# EasyEDA Pro project ProPrj_IRIS_2026-04-09.epro, board PCB1
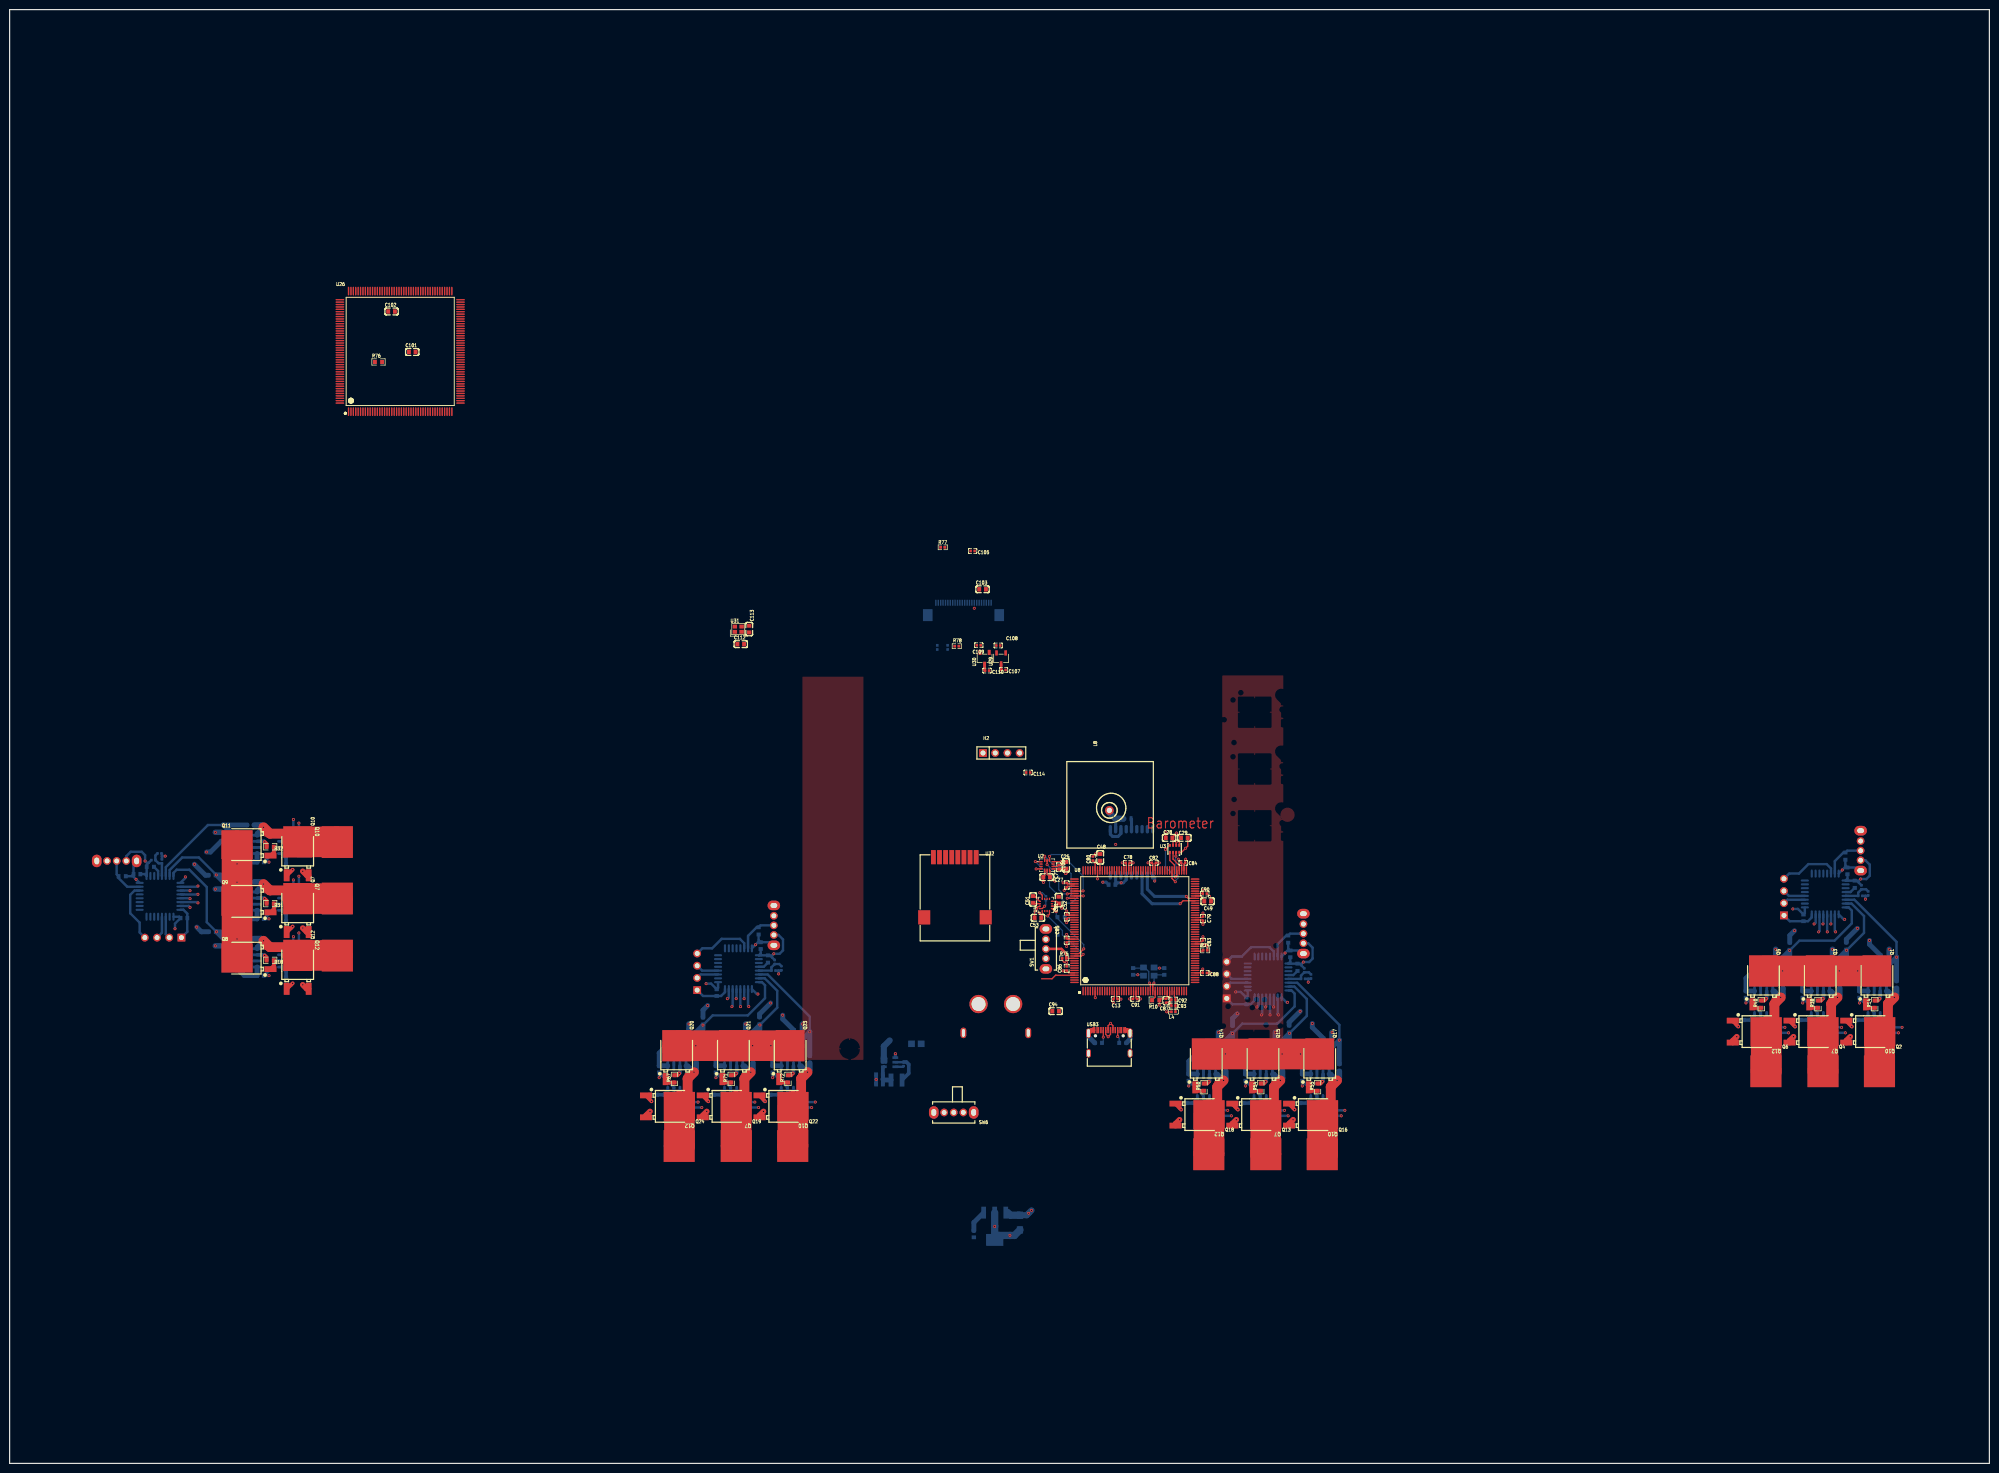
[diagram p2: board, top side]
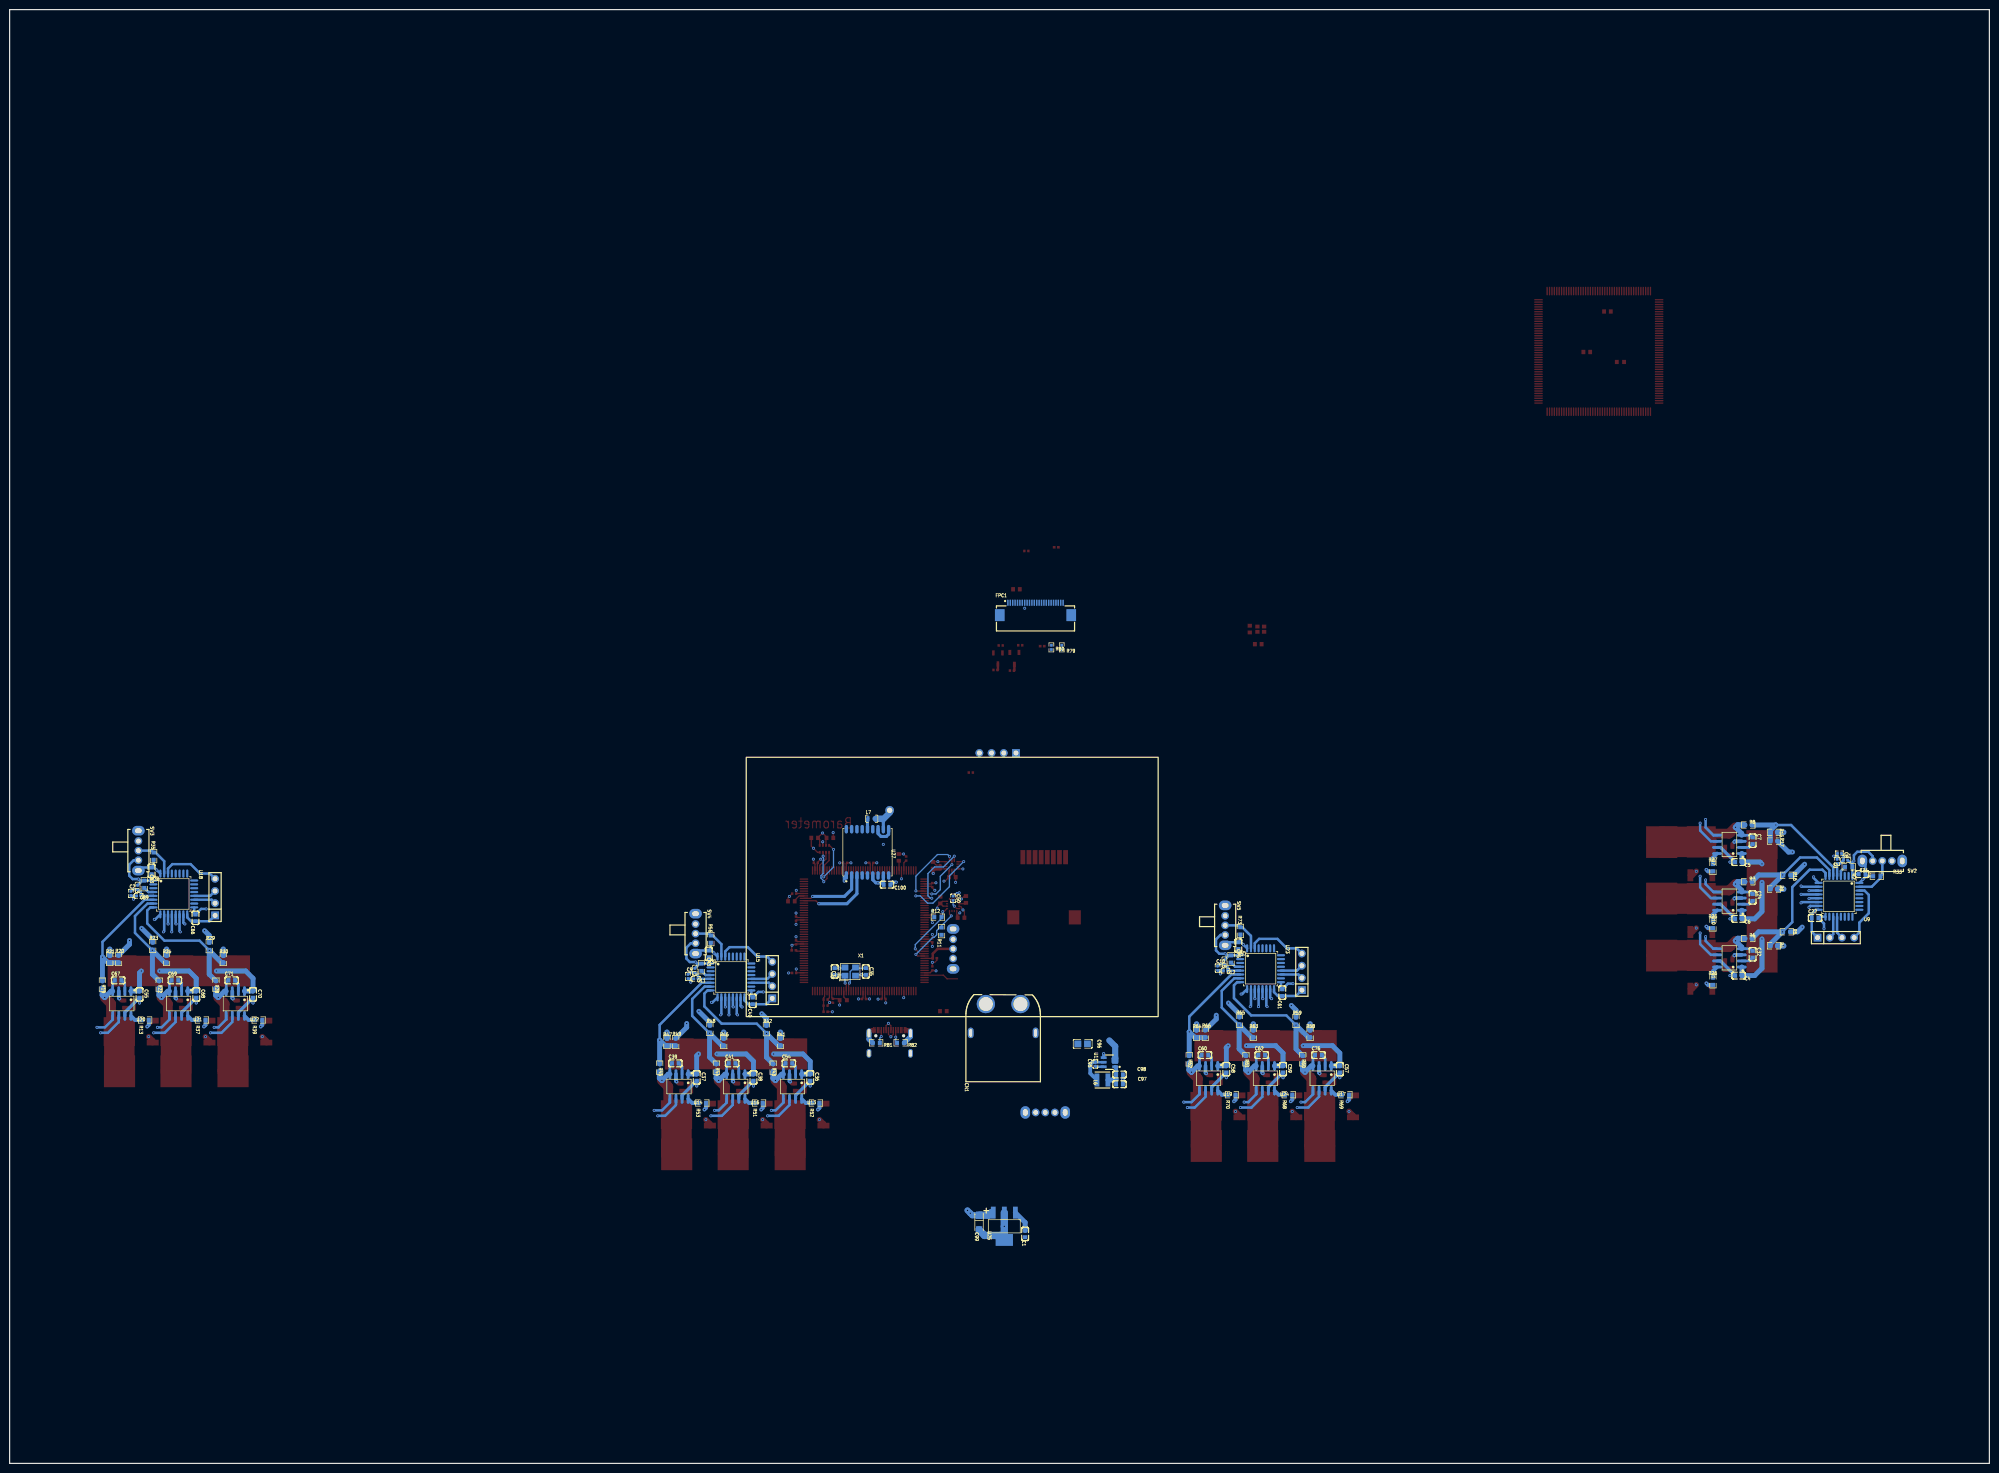
[diagram p3: board, bottom side, seen from below]

Outline 411.99 x 302.51 mm; copper layers: Top Layer, Ground, Power, Bottom Layer. Coordinates in mm from the lower left corner of the outline.
Outline path: rectangle 0,302.51 411.99,0
Stack: Top Layer 0.035mm Outer layer thickness 1oz / Dielectric1 0.2104mm 7628 RC49% 8.6mil / Ground 0.0152mm Inner layer thickness / Dielectric2 1.065mm 1.1mm H/HOZ Copper / Power 0.0152mm Inner layer thickness / Dielectric3 0.2104mm 7628 RC49% 8.6mil / Bottom Layer 0.035mm Outer layer thickness 1oz

## Design rules (mm)
template: JLCPCB Capability(Two Layers Board)
spacing copperThickness1oz (default): track to track 0.102, other pairs 0.152 to 0.3
spacing copperThickness2oz: track to track 0.203, other pairs 0.152 to 0.3
track width copperThickness1oz (default): min 0.127, default 0.254, max 2.54
track width copperThickness2oz: min 0.203, default 0.254, max 2.54
differential pair differentialPair (default): width min 0.127, default 0.254, max 2.54; gap min 0.152, default 0.152
via viaSize (default): diameter min 0.5, default 0.61, max 10; hole min 0.3, default 0.305, max 6.3

## Placement (name value [footprint] x y rotation side)
C1  10uF  [C0603]  200.66 47.75 90 bottom
C2  1uF  [C0402]  386.76 118.6 90 bottom
C3  100nF  [C0402]  31.69 125.28 90 bottom
C4  10uF  [C0603]  52.2 101.5 180 bottom
C5  10uF  [C0603]  52.2 125.13 180 bottom
C6  10uF  [C0603]  52.2 113.32 180 bottom
C7  100nF  [C0603]  49.28 129.57 270 bottom
C8  1uF  [C0402]  31.19 126.93 180 bottom
C9  1uF  [C0402]  270.81 101.33 90 bottom
C10  1uF  [C0402]  160.6 103.05 90 bottom
C11  100nF  [C0402]  269.16 100.82 0 bottom
C12  100nF  [C0402]  158.95 102.55 0 bottom
C13  100nF  [C0402]  230.12 96.65 0 top
C22  100nF  [C0603]  36.27 113.48 180 bottom
C24  100nF  [C0603]  49.28 117.76 270 bottom
C25  2.2uF  [C0603]  219.84 124.46 270 top
C27  10nF  [C0603]  215.8 121.99 180 top
C28  100nF  [C0603]  241.29 130.16 180 top
C29  100nF  [C0603]  244.46 130.16 0 top
C31  100nF  [C0603]  26.49 122.62 180 bottom
C32  100nF  [C0603]  49.28 105.95 270 bottom
C34  10pF  [C0603]  240.28 102.36 90 bottom
C35  10pF  [C0603]  233.81 102.36 270 bottom
C36  10uF  [C0603]  245.38 80.32 90 bottom
C37  10uF  [C0603]  269 80.32 90 bottom
C38  10uF  [C0603]  257.19 80.32 90 bottom
C39  100nF  [C0603]  273.45 83.24 180 bottom
C40  100nF  [C0603]  257.36 96.25 90 bottom
C41  100nF  [C0603]  261.64 83.24 180 bottom
C43  100nF  [C0603]  266.5 106.02 90 bottom
C48  2.2uF  [C0603]  226.95 126.11 90 top
C49  2.2uF  [C0603]  249.3 116.97 0 top
C50  220nF  [C0402]  215.65 117.6 270 bottom
C51  4.7uF  [C0603]  212.98 117.35 90 top
C52  100nF  [C0603]  218.31 117.22 90 top
C53  100nF  [C0603]  214 113.54 180 top
C54  100nF  [C0603]  249.83 83.24 180 bottom
C55  10uF  [C0603]  384.96 97.59 90 bottom
C57  10uF  [C0603]  135.18 82.04 90 bottom
C58  10uF  [C0603]  158.8 82.04 90 bottom
C59  10uF  [C0603]  146.99 82.04 90 bottom
C60  100nF  [C0603]  163.24 84.96 180 bottom
C61  100nF  [C0603]  147.15 97.97 90 bottom
C62  100nF  [C0603]  151.43 84.96 180 bottom
C63  100nF  [C0603]  382.45 123.3 90 bottom
C66  100nF  [C0603]  373.31 113.52 90 bottom
C67  100nF  [C0603]  389.4 100.52 180 bottom
C68  10uF  [C0603]  373.14 97.59 90 bottom
C69  100nF  [C0603]  377.59 100.52 180 bottom
C70  10uF  [C0603]  361.33 97.59 90 bottom
C71  100nF  [C0603]  365.78 100.52 180 bottom
C75  100nF  [C0603]  156.29 107.74 90 bottom
C76  100nF  [C0603]  139.62 84.96 180 bottom
C77  100nF  [C0402]  219.99 120.34 270 top
C78  100nF  [C0402]  232.66 124.97 180 top
C79  100nF  [C0402]  248.33 113.36 90 top
C80  100nF  [C0402]  225.43 125.86 270 top
C81  100nF  [C0402]  219.99 113.74 270 top
C82  100nF  [C0402]  238.12 124.97 180 top
C83  100nF  [C0402]  248.33 108.4 90 top
C84  100nF  [C0402]  244.22 124.97 180 top
C85  100nF  [C0402]  219.96 108.84 270 top
C86  100nF  [C0402]  219.96 103 270 top
C87  100nF  [C0402]  240.66 96.27 90 top
C88  100nF  [C0402]  248.73 102.05 180 top
C89  100nF  [C0402]  385.11 118.1 0 bottom
C90  100nF  [C0402]  248.71 118.56 180 top
C91  100nF  [C0402]  234.19 96.65 0 top
C92  100nF  [C0402]  242.19 96.52 0 top
C93  1uF  [C0402]  242.19 95.25 0 top
C94  4.7uF  [C0603]  217.68 94.11 0 top
C95  100nF  [C0402]  186.04 83.1 270 bottom
C96  10uF  [C0805]  188.69 87.31 180 bottom
C97  22uF  [C0603]  181.02 78.9 0 bottom
C98  22uF  [C0603]  181.02 80.92 0 bottom
C99  10uF  [CAP-SMD_L3.2-W1.6-RD-C7171]  210.25 50.11 270 bottom
C100  10uF  [C0603]  229.4 120.43 0 bottom
C101  2.2uF  [C0603]  83.78 231.27 0 top
C102  2.2uF  [C0603]  79.49 239.7 0 top
C103  15pF  [C0603]  202.47 181.9 0 top
C105  100nF  [C0402]  200.41 189.87 180 top
C106  100nF  [C0402]  218.31 124.08 90 top
C107  1uF  [C0402]  206.83 165.1 180 top
C108  1uF  [C0402]  205.74 170.2 180 top
C109  1uF  [C0402]  201.68 170.25 0 top
C110  1uF  [C0402]  203.4 164.97 180 top
C112  10pF  [C0603]  152.15 170.47 0 top
C113  10pF  [C0603]  153.91 173.61 270 top
C114  100nF  [C0402]  211.96 143.76 180 top
CN1  XT60PW-M  [CONN-TH_XT60PW-M]  205.23 92.58 90 bottom
FPC1  FPC-05F-24PH20  [FPC-SMD_24P-P0.50_FPC-05F-24PH20]  198.5 177.8 180 bottom
H1  HX PH254-01-04-Z-L11.5 straight pin header  [HDR-TH_4P-HX-PH254-01-04-Z-L11.5]  369.23 117.84 90 bottom
H2  HX PH254-01-04-Z-L11.5 straight pin header  [HDR-TH_4P-HX-PH254-01-04-Z-L11.5]  206.38 147.83 0 top
H3  HX PH254-01-04-Z-L11.5 straight pin header  [HDR-TH_4P-HX-PH254-01-04-Z-L11.5]  31.95 109.41 180 bottom
H4  HX PH254-01-04-Z-L11.5 straight pin header  [HDR-TH_4P-HX-PH254-01-04-Z-L11.5]  253.28 100.57 90 bottom
H5  HX PH254-01-04-Z-L11.5 straight pin header  [HDR-TH_4P-HX-PH254-01-04-Z-L11.5]  143.08 102.29 90 bottom
L1  BLM15PD121SN1D  [L0402]  29.92 125.53 180 bottom
L2  BLM15PD121SN1D  [L0402]  269.41 102.6 90 bottom
L3  BLM15PD121SN1D  [L0402]  385.36 119.87 90 bottom
L4  BLM15PD121SN1D  [L0402]  242.19 93.98 0 top
L5  BLM15PD121SN1D  [L0402]  159.21 104.32 90 bottom
L6  4.7uH  [IND-SMD_L3.0-W3.0-1]  184.57 79.77 180 bottom
L7  47nH  [IND-SMD_L1.8-W1.0]  232.58 134.14 180 bottom
L8  BWGNSCNX18-18W4  [ANT-TH_L18.0-W18.0_C9900026472]  228.85 135.89 0 top
NOREF  -  [Pad_e845]  377.37 81.59 0 top
NOREF#2  -  [Pad_e2491]  68.2 105.66 90 top
NOREF#3  -  [Pad_e2490]  68.2 129.29 90 top
NOREF#4  -  [Pad_e844]  365.49 81.59 0 top
NOREF#5  -  [Pad_e1895]  139.34 66.04 0 top
NOREF#6  -  [Pad_e1565]  273.16 64.32 0 top
NOREF#7  -  [Pad_e2492]  68.2 117.54 90 top
NOREF#8  -  [Pad_e1896]  151.21 66.04 0 top
NOREF#9  -  [Pad_e1567]  261.42 64.32 0 top
NOREF#10  -  [Pad_e1894]  162.96 66.04 0 top
NOREF#11  -  [Pad_e843]  389.11 81.59 0 top
NOREF#12  -  [Pad_e1566]  249.54 64.32 0 top
Q1  IRLR7843TRPBF  [TO-252-3_L6.6-W6.1-P4.57-LS9.9-BR-CW]  388.59 98.99 270 top
Q2  IRLR7843TRPBF  [TO-252-3_L6.6-W6.1-P4.57-LS9.9-BR-CW]  385.69 89.85 180 top
Q3  IRLR7843TRPBF  [TO-252-3_L6.6-W6.1-P4.57-LS9.9-BR-CW]  376.78 98.99 270 top
Q4  IRLR7843TRPBF  [TO-252-3_L6.6-W6.1-P4.57-LS9.9-BR-CW]  373.87 89.85 180 top
Q5  IRLR7843TRPBF  [TO-252-3_L6.6-W6.1-P4.57-LS9.9-BR-CW]  364.97 98.99 270 top
Q6  IRLR7843TRPBF  [TO-252-3_L6.6-W6.1-P4.57-LS9.9-BR-CW]  362.06 89.85 180 top
Q7  IRLR7843TRPBF  [TO-252-3_L6.6-W6.1-P4.57-LS9.9-BR-CW]  59.94 114.05 270 top
Q8  IRLR7843TRPBF  [TO-252-3_L6.6-W6.1-P4.57-LS9.9-BR-CW]  50.8 105.14 0 top
Q9  IRLR7843TRPBF  [TO-252-3_L6.6-W6.1-P4.57-LS9.9-BR-CW]  50.8 116.95 0 top
Q10  IRLR7843TRPBF  [TO-252-3_L6.6-W6.1-P4.57-LS9.9-BR-CW]  59.94 125.86 270 top
Q11  IRLR7843TRPBF  [TO-252-3_L6.6-W6.1-P4.57-LS9.9-BR-CW]  50.8 128.76 0 top
Q12  IRLR7843TRPBF  [TO-252-3_L6.6-W6.1-P4.57-LS9.9-BR-CW]  59.94 102.24 270 top
Q13  IRLR7843TRPBF  [TO-252-3_L6.6-W6.1-P4.57-LS9.9-BR-CW]  257.92 72.58 180 top
Q14  IRLR7843TRPBF  [TO-252-3_L6.6-W6.1-P4.57-LS9.9-BR-CW]  249.02 81.72 270 top
Q15  IRLR7843TRPBF  [TO-252-3_L6.6-W6.1-P4.57-LS9.9-BR-CW]  260.83 81.72 270 top
Q16  IRLR7843TRPBF  [TO-252-3_L6.6-W6.1-P4.57-LS9.9-BR-CW]  269.73 72.58 180 top
Q17  IRLR7843TRPBF  [TO-252-3_L6.6-W6.1-P4.57-LS9.9-BR-CW]  272.64 81.72 270 top
Q18  IRLR7843TRPBF  [TO-252-3_L6.6-W6.1-P4.57-LS9.9-BR-CW]  246.11 72.58 180 top
Q19  IRLR7843TRPBF  [TO-252-3_L6.6-W6.1-P4.57-LS9.9-BR-CW]  147.72 74.3 180 top
Q20  IRLR7843TRPBF  [TO-252-3_L6.6-W6.1-P4.57-LS9.9-BR-CW]  138.81 83.44 270 top
Q21  IRLR7843TRPBF  [TO-252-3_L6.6-W6.1-P4.57-LS9.9-BR-CW]  150.62 83.44 270 top
Q22  IRLR7843TRPBF  [TO-252-3_L6.6-W6.1-P4.57-LS9.9-BR-CW]  159.53 74.3 180 top
Q23  IRLR7843TRPBF  [TO-252-3_L6.6-W6.1-P4.57-LS9.9-BR-CW]  162.43 83.44 270 top
Q24  IRLR7843TRPBF  [TO-252-3_L6.6-W6.1-P4.57-LS9.9-BR-CW]  135.91 74.3 180 top
R2  10kΩ  [R0603]  29.28 124.14 0 bottom
R4  10kΩ  [R0603]  44.83 107.7 0 bottom
R5  33kΩ  [R0603]  42.16 110.62 0 bottom
R6  33kΩ  [R0603]  50.16 109.22 0 bottom
R7  33kΩ  [R0603]  50.16 121.03 0 bottom
R8  33kΩ  [R0603]  50.16 132.84 0 bottom
R9  10kΩ  [R0603]  44.83 119.51 0 bottom
R10  10kΩ  [R0603]  238.51 96.39 180 top
R11  2.2kΩ  [R0603]  218.06 110.74 90 bottom
R12  2.2kΩ  [R0603]  218.82 113.67 180 bottom
R13  100Ω  [R0603]  383.78 92.26 180 bottom
R14  100Ω  [R0603]  388.13 95.56 270 top
R15  10kΩ  [R0603]  44.83 131.32 0 bottom
R16  33kΩ  [R0603]  42.12 122.39 0 bottom
R17  33kΩ  [R0603]  44.83 129.5 0 bottom
R18  100Ω  [R0603]  54.23 104.68 0 top
R19  33kΩ  [R0603]  392.67 99.63 270 bottom
R20  33kΩ  [R0603]  389.33 104.96 270 bottom
R21  10kΩ  [R0603]  391.15 104.96 270 bottom
R22  33kΩ  [R0603]  380.86 99.63 270 bottom
R23  33kΩ  [R0603]  382.21 107.67 270 bottom
R24  10kΩ  [R0603]  379.34 104.96 270 bottom
R25  100Ω  [R0603]  57.53 112.14 270 bottom
R26  100Ω  [R0603]  57.53 100.33 270 bottom
R27  100Ω  [R0603]  57.53 123.95 270 bottom
R28  33kΩ  [R0603]  369.05 99.63 270 bottom
R29  33kΩ  [R0603]  370.45 107.63 270 bottom
R30  10kΩ  [R0603]  367.52 104.96 270 bottom
R31  100Ω  [R0603]  54.23 116.49 0 top
R32  100Ω  [R0603]  54.23 128.3 0 top
R33  10kΩ  [R0603]  23.43 122.19 0 bottom
R34  10kΩ  [R0603]  268.02 103.24 270 bottom
R35  10kΩ  [R0603]  382.02 126.37 270 bottom
R36  10kΩ  [R0603]  383.97 120.51 270 bottom
R37  100Ω  [R0603]  371.97 92.26 180 bottom
R38  100Ω  [R0603]  376.32 95.56 270 top
R39  100Ω  [R0603]  360.16 92.26 180 bottom
R40  100Ω  [R0603]  364.51 95.56 270 top
R41  10kΩ  [R0603]  251.57 87.69 270 bottom
R42  33kΩ  [R0603]  254.49 90.36 270 bottom
R43  33kΩ  [R0603]  253.1 82.35 270 bottom
R44  33kΩ  [R0603]  264.91 82.35 270 bottom
R45  33kΩ  [R0603]  276.72 82.35 270 bottom
R46  10kΩ  [R0603]  263.38 87.69 270 bottom
R47  10kΩ  [R0603]  275.2 87.69 270 bottom
R48  33kΩ  [R0603]  266.26 90.4 270 bottom
R49  33kΩ  [R0603]  273.38 87.69 270 bottom
R50  100Ω  [R0603]  248.56 78.29 270 top
R51  100Ω  [R0603]  256.02 74.99 180 bottom
R52  100Ω  [R0603]  244.21 74.99 180 bottom
R53  100Ω  [R0603]  267.83 74.99 180 bottom
R54  100Ω  [R0603]  260.37 78.29 270 top
R55  100Ω  [R0603]  272.18 78.29 270 top
R56  10kΩ  [R0603]  266.06 109.09 270 bottom
R57  10kΩ  [R0603]  157.81 104.96 270 bottom
R58  10kΩ  [R0603]  141.37 89.41 270 bottom
R59  33kΩ  [R0603]  144.29 92.08 270 bottom
R60  33kΩ  [R0603]  142.89 84.07 270 bottom
R61  33kΩ  [R0603]  154.7 84.07 270 bottom
R62  33kΩ  [R0603]  166.51 84.07 270 bottom
R63  10kΩ  [R0603]  153.18 89.41 270 bottom
R64  10kΩ  [R0603]  164.99 89.41 270 bottom
R65  33kΩ  [R0603]  156.06 92.12 270 bottom
R66  33kΩ  [R0603]  163.17 89.41 270 bottom
R67  100Ω  [R0603]  138.35 80.01 270 top
R68  100Ω  [R0603]  145.81 76.71 180 bottom
R69  100Ω  [R0603]  134 76.71 180 bottom
R70  100Ω  [R0603]  157.62 76.71 180 bottom
R71  100Ω  [R0603]  150.16 80.01 270 top
R72  100Ω  [R0603]  161.97 80.01 270 top
R73  10kΩ  [R0603]  155.86 110.81 270 bottom
R74  10kΩ  [R0402]  248.8 106.76 0 top
R75  10kΩ  [R0402]  219.46 105.11 180 top
R76  10kΩ  [R0603]  76.77 229.2 0 top
R77  1kΩ  [R0402]  194.18 190.63 0 top
R78  4.7kΩ  [R0402]  197.1 170.05 180 top
R79  4.7kΩ  [R0402]  193.04 169.8 90 bottom
R80  4.7kΩ  [R0402]  195.2 169.8 90 bottom
R81  5.1kΩ  [R0603]  231.65 87.5 0 bottom
R82  5.1kΩ  [R0603]  226.57 87.5 0 bottom
SW1  -  [SW-TH_SK12D07VG3]  215.65 107.06 270 top
SW2  -  [SW-TH_SK12D07VG3]  22.28 125.36 0 bottom
SW3  -  [SW-TH_SK12D07VG3]  385.19 127.51 270 bottom
SW4  -  [SW-TH_SK12D07VG3]  269.24 110.24 270 bottom
SW5  -  [SW-TH_SK12D07VG3]  159.03 111.96 270 bottom
SW6  -  [SW-TH_SK12D07VG3]  196.47 73.03 180 top
U1  MIC4604YM-TR  [SOIC-8_L4.9-W3.9-P1.27-LS6.0-BL]  54.1 105.19 90 bottom
U2  ICM-42688-P  [LGA-14_L3.0-W2.5-P0.50-TL]  215.9 124.46 0 top
U3  BMP280  [LGA-8_L2.5-W2.0-P0.65_AMP6127]  242.43 127.88 270 top
U4  QMC5883L  [LGA-16_L3.0-W3.0-P0.50-BL_SQ]  215.65 116.21 90 top
U7  MIC4604YM-TR  [SOIC-8_L4.9-W3.9-P1.27-LS6.0-BL]  54.1 128.81 90 bottom
U8  STM32F407IGT6  [LQFP-176_L24.0-W24.0-P0.50-BL]  234.14 110.84 0 top
U9  AT32F421K8T7  [LQFP-32_L7.0-W7.0-P0.80-LS9.0-BL]  31.3 118 0 bottom
U10  MIC4604YM-TR  [SOIC-8_L4.9-W3.9-P1.27-LS6.0-BL]  54.1 117 90 bottom
U11  AP63205WU-7  [TSOT-23-6_L2.9-W1.6-P0.95-LS2.8-BL]  183.12 83.48 90 bottom
U13  MIC4604YM-TR  [SOIC-8_L4.9-W3.9-P1.27-LS6.0-BL]  249.07 78.42 0 bottom
U14  MIC4604YM-TR  [SOIC-8_L4.9-W3.9-P1.27-LS6.0-BL]  272.69 78.42 0 bottom
U15  AT32F421K8T7  [LQFP-32_L7.0-W7.0-P0.80-LS9.0-BL]  261.87 101.22 270 bottom
U16  MIC4604YM-TR  [SOIC-8_L4.9-W3.9-P1.27-LS6.0-BL]  260.88 78.42 0 bottom
U17  MIC4604YM-TR  [SOIC-8_L4.9-W3.9-P1.27-LS6.0-BL]  138.86 80.14 0 bottom
U18  AT32F421K8T7  [LQFP-32_L7.0-W7.0-P0.80-LS9.0-BL]  377.82 118.49 270 bottom
U19  MIC4604YM-TR  [SOIC-8_L4.9-W3.9-P1.27-LS6.0-BL]  162.48 80.14 0 bottom
U20  MIC4604YM-TR  [SOIC-8_L4.9-W3.9-P1.27-LS6.0-BL]  388.64 95.69 0 bottom
U21  MIC4604YM-TR  [SOIC-8_L4.9-W3.9-P1.27-LS6.0-BL]  376.83 95.69 0 bottom
U22  MIC4604YM-TR  [SOIC-8_L4.9-W3.9-P1.27-LS6.0-BL]  365.02 95.69 0 bottom
U23  AT32F421K8T7  [LQFP-32_L7.0-W7.0-P0.80-LS9.0-BL]  151.67 102.94 270 bottom
U24  MIC4604YM-TR  [SOIC-8_L4.9-W3.9-P1.27-LS6.0-BL]  150.67 80.14 0 bottom
U25  MIC39100-3.3WS-TR  [SOT-223-4_L6.5-W3.5-P2.30-LS7.0-BR]  204.99 49.34 90 bottom
U26  STM32H743IIT6  [LQFP-176_L24.0-W24.0-P0.50-LS26.0-BL]  81.28 231.39 0 top
U27  ATGM336H-5N31  [GPSM-SMD_ATGM336H-TR]  233.46 127.16 0 bottom
U29  XC6206-1.2V  [SOT-23-3_L3.0-W1.6-P1.90-LS2.8-BR]  206.32 167.51 90 top
U30  XC6206-2.8V  [SOT-23-3_L2.9-W1.6-P1.90-LS2.8-BR]  202.9 167.51 90 top
U31  48MHz  [CRYSTAL-SMD_4P-L2.0-W1.6-BL]  151.63 173.59 0 top
U32  E01C-ML01SP4  [COMM-SMD_E01C-ML01SP4]  196.72 119.89 0 top
USB3  -  [USB-C-SMD_KH-TYPE-C-16P]  228.84 87.75 0 top
X1  8MHz  [CRYSTAL-SMD_4P-L3.2-W2.5-BL]  237.06 102.34 180 bottom

## Footprints (pads in the part's own frame, mm; a bottom-side part is the same pattern mirrored in y, then rotated)
ANT-TH_L18.0-W18.0_C9900026472
  round 1.8 hole 1.1: 1(0,0)
C0402
  rect 0.5x0.54 smd: 1(-0.42,0) 2(0.42,0)
C0603
  rect 0.8x0.9 smd: 1(-0.7,0) 2(0.7,0)
C0805
  rect 1.41x1.35 smd: 1(-1,0) 2(1,0)
CAP-SMD_L3.2-W1.6-RD-C7171
  rect 1.53x1.296 smd: 1(-1.53,0) 2(1.53,0)
COMM-SMD_E01C-ML01SP4
  rect 1x2.95 smd: 1(4.41,6.26) 2(3.14,6.26) 3(1.87,6.26) 4(0.6,6.26) 5(-0.67,6.26) 6(-1.94,6.26) 7(-3.21,6.26) 8(-4.48,6.26)
  rect 2.5x2.95 smd: 9(-6.4,-6.26) 10(6.4,-6.255)
CONN-TH_XT60PW-M
  round 3.8 hole 2.9: 1(3,-3.6) 2(3,3.6)
  oval 2.2x1.2 hole 1.6x0.6: 3(-3,6.75) 4(-3,-6.75)
CRYSTAL-SMD_4P-L2.0-W1.6-BL
  rect 0.9x0.8 smd: 1(-0.7,-0.55) 2(0.7,-0.55) 3(0.7,0.55) 4(-0.7,0.55)
CRYSTAL-SMD_4P-L3.2-W2.5-BL
  rect 1.4x1.2 smd: 1(-1.1,-0.85) 2(1.1,-0.85) 3(1.1,0.85) 4(-1.1,0.85)
FPC-SMD_24P-P0.50_FPC-05F-24PH20
  rect 0.3x1.25 smd: 1(-5.75,1.288) 2(-5.25,1.288) 3(-4.75,1.288) 4(-4.25,1.288) 5(-3.75,1.288) 6(-3.25,1.288) 7(-2.75,1.288) 8(-2.25,1.288) 9(-1.75,1.288) 10(-1.25,1.288) 11(-0.75,1.288) 12(-0.25,1.288) 13(0.25,1.288) 14(0.75,1.288) 15(1.25,1.288) 16(1.75,1.288) 17(2.25,1.288) 18(2.75,1.288) 19(3.25,1.288) 20(3.75,1.288) 21(4.25,1.288) 22(4.75,1.288) 23(5.25,1.288) 24(5.75,1.288)
  rect 2x2.5 smd: 25(7.44,-1.288) 26(-7.44,-1.288)
GPSM-SMD_ATGM336H-TR
  oval 0.7x1.773 smd: 1(4.4,4.811) 2(3.3,4.811) 3(2.2,4.811) 4(1.1,4.811) 5(0,4.811) 6(-1.1,4.811) 7(-2.2,4.811) 8(-3.3,4.811) 9(-4.4,4.811) 10(-4.4,-4.811) 11(-3.3,-4.811) 12(-2.2,-4.811) 13(-1.1,-4.811) 14(0,-4.811) 15(1.1,-4.811) 16(2.2,-4.811) 17(3.3,-4.811) 18(4.4,-4.811)
HDR-TH_4P-HX-PH254-01-04-Z-L11.5
  rect 1.62x1.62 hole 1.02: 1(-3.81,0)
  round 1.62 hole 1.02: 2(-1.27,0) 3(1.27,0) 4(3.81,0)
IND-SMD_L1.8-W1.0
  rect 0.6x1.08 smd: 1(-0.8,0) 2(0.8,0)
IND-SMD_L3.0-W3.0-1
  rect 1x2.7 smd: 1(-1.15,0) 2(1.15,0)
L0402
  rect 0.54x0.54 smd: 1(-0.42,0) 2(0.42,0)
LGA-8_L2.5-W2.0-P0.65_AMP6127
  rect 0.6x0.4 smd: 1(0.725,0.975) 2(0.725,0.325) 3(0.725,-0.325) 4(0.725,-0.975) 5(-0.725,-0.975) 6(-0.725,-0.325) 7(-0.725,0.325) 8(-0.725,0.975)
LGA-14_L3.0-W2.5-P0.50-TL
  rect 0.675x0.28 smd: 1(-1.262,0.75) 2(-1.262,0.25) 3(-1.262,-0.25) 4(-1.262,-0.75) 8(1.262,-0.75) 9(1.262,-0.25) 10(1.262,0.25) 11(1.262,0.75)
  rect 0.28x0.675 smd: 5(-0.5,-1.012) 6(0,-1.012) 7(0.5,-1.012) 12(0.5,1.012) 13(0,1.012) 14(-0.5,1.012)
LGA-16_L3.0-W3.0-P0.50-BL_SQ
  rect 0.25x0.45 smd: 1(-0.75,-1.263) 2(-0.25,-1.263) 3(0.25,-1.263) 4(0.75,-1.263) 9(0.75,1.263) 10(0.25,1.263) 11(-0.25,1.263) 12(-0.75,1.263)
  rect 0.45x0.25 smd: 5(1.263,-0.75) 6(1.263,-0.25) 7(1.263,0.25) 8(1.263,0.75) 13(-1.263,0.75) 14(-1.263,0.25) 15(-1.263,-0.25) 16(-1.263,-0.75)
LQFP-32_L7.0-W7.0-P0.80-LS9.0-BL
  oval 0.448x1.684 smd: 1(-2.8,-4.242) 2(-2,-4.242) 3(-1.2,-4.242) 4(-0.4,-4.242) 5(0.4,-4.242) 6(1.2,-4.242) 7(2,-4.242) 8(2.8,-4.242) 17(2.8,4.242) 18(2,4.242) 19(1.2,4.242) 20(0.4,4.242) 21(-0.4,4.242) 22(-1.2,4.242) 23(-2,4.242) 24(-2.8,4.242)
  oval 1.684x0.448 smd: 9(4.242,-2.8) 10(4.242,-2) 11(4.242,-1.2) 12(4.242,-0.4) 13(4.242,0.4) 14(4.242,1.2) 15(4.242,2) 16(4.242,2.8) 25(-4.242,2.8) 26(-4.242,2) 27(-4.242,1.2) 28(-4.242,0.4) 29(-4.242,-0.4) 30(-4.242,-1.2) 31(-4.242,-2) 32(-4.242,-2.8)
LQFP-176_L24.0-W24.0-P0.50-BL
  oval 0.28x1.8 smd: 1(-10.75,-12.55) 2(-10.25,-12.55) 3(-9.75,-12.55) 4(-9.25,-12.55) 5(-8.75,-12.55) 6(-8.25,-12.55) 7(-7.75,-12.55) 8(-7.25,-12.55) 9(-6.75,-12.55) 10(-6.25,-12.55) 11(-5.75,-12.55) 12(-5.25,-12.55) 13(-4.75,-12.55) 14(-4.25,-12.55) 15(-3.75,-12.55) 16(-3.25,-12.55) 17(-2.75,-12.55) 18(-2.25,-12.55) 19(-1.75,-12.55) 20(-1.25,-12.55) 21(-0.75,-12.55) 22(-0.25,-12.55) 23(0.25,-12.55) 24(0.75,-12.55) 25(1.25,-12.55) 26(1.75,-12.55) 27(2.25,-12.55) 28(2.75,-12.55) 29(3.25,-12.55) 30(3.75,-12.55) 31(4.25,-12.55) 32(4.75,-12.55) 33(5.25,-12.55) 34(5.75,-12.55) 35(6.25,-12.55) 36(6.75,-12.55) 37(7.25,-12.55) 38(7.75,-12.55) 39(8.25,-12.55) 40(8.75,-12.55) 41(9.25,-12.55) 42(9.75,-12.55) 43(10.25,-12.55) 44(10.75,-12.55) 89(10.75,12.55) 90(10.25,12.55) 91(9.75,12.55) 92(9.25,12.55) 93(8.75,12.55) 94(8.25,12.55) 95(7.75,12.55) 96(7.25,12.55) 97(6.75,12.55) 98(6.25,12.55) 99(5.75,12.55) 100(5.25,12.55) 101(4.75,12.55) 102(4.25,12.55) 103(3.75,12.55) 104(3.25,12.55) 105(2.75,12.55) 106(2.25,12.55) 107(1.75,12.55) 108(1.25,12.55) 109(0.75,12.55) 110(0.25,12.55) 111(-0.25,12.55) 112(-0.75,12.55) 113(-1.25,12.55) 114(-1.75,12.55) 115(-2.25,12.55) 116(-2.75,12.55) 117(-3.25,12.55) 118(-3.75,12.55) 119(-4.25,12.55) 120(-4.75,12.55) 121(-5.25,12.55) 122(-5.75,12.55) 123(-6.25,12.55) 124(-6.75,12.55) 125(-7.25,12.55) 126(-7.75,12.55) 127(-8.25,12.55) 128(-8.75,12.55) 129(-9.25,12.55) 130(-9.75,12.55) 131(-10.25,12.55) 132(-10.75,12.55)
  oval 1.8x0.28 smd: 45(12.55,-10.75) 46(12.55,-10.25) 47(12.55,-9.75) 48(12.55,-9.25) 49(12.55,-8.75) 50(12.55,-8.25) 51(12.55,-7.75) 52(12.55,-7.25) 53(12.55,-6.75) 54(12.55,-6.25) 55(12.55,-5.75) 56(12.55,-5.25) 57(12.55,-4.75) 58(12.55,-4.25) 59(12.55,-3.75) 60(12.55,-3.25) 61(12.55,-2.75) 62(12.55,-2.25) 63(12.55,-1.75) 64(12.55,-1.25) 65(12.55,-0.75) 66(12.55,-0.25) 67(12.55,0.25) 68(12.55,0.75) 69(12.55,1.25) 70(12.55,1.75) 71(12.55,2.25) 72(12.55,2.75) 73(12.55,3.25) 74(12.55,3.75) 75(12.55,4.25) 76(12.55,4.75) 77(12.55,5.25) 78(12.55,5.75) 79(12.55,6.25) 80(12.55,6.75) 81(12.55,7.25) 82(12.55,7.75) 83(12.55,8.25) 84(12.55,8.75) 85(12.55,9.25) 86(12.55,9.75) 87(12.55,10.25) 88(12.55,10.75) 133(-12.55,10.75) 134(-12.55,10.25) 135(-12.55,9.75) 136(-12.55,9.25) 137(-12.55,8.75) 138(-12.55,8.25) 139(-12.55,7.75) 140(-12.55,7.25) 141(-12.55,6.75) 142(-12.55,6.25) 143(-12.55,5.75) 144(-12.55,5.25) 145(-12.55,4.75) 146(-12.55,4.25) 147(-12.55,3.75) 148(-12.55,3.25) 149(-12.55,2.75) 150(-12.55,2.25) 151(-12.55,1.75) 152(-12.55,1.25) 153(-12.55,0.75) 154(-12.55,0.25) 155(-12.55,-0.25) 156(-12.55,-0.75) 157(-12.55,-1.25) 158(-12.55,-1.75) 159(-12.55,-2.25) 160(-12.55,-2.75) 161(-12.55,-3.25) 162(-12.55,-3.75) 163(-12.55,-4.25) 164(-12.55,-4.75) 165(-12.55,-5.25) 166(-12.55,-5.75) 167(-12.55,-6.25) 168(-12.55,-6.75) 169(-12.55,-7.25) 170(-12.55,-7.75) 171(-12.55,-8.25) 172(-12.55,-8.75) 173(-12.55,-9.25) 174(-12.55,-9.75) 175(-12.55,-10.25) 176(-12.55,-10.75)
LQFP-176_L24.0-W24.0-P0.50-LS26.0-BL
  oval 0.28x1.8 smd: 1(-10.75,-12.55) 2(-10.25,-12.55) 3(-9.75,-12.55) 4(-9.25,-12.55) 5(-8.75,-12.55) 6(-8.25,-12.55) 7(-7.75,-12.55) 8(-7.25,-12.55) 9(-6.75,-12.55) 10(-6.25,-12.55) 11(-5.75,-12.55) 12(-5.25,-12.55) 13(-4.75,-12.55) 14(-4.25,-12.55) 15(-3.75,-12.55) 16(-3.25,-12.55) 17(-2.75,-12.55) 18(-2.25,-12.55) 19(-1.75,-12.55) 20(-1.25,-12.55) 21(-0.75,-12.55) 22(-0.25,-12.55) 23(0.25,-12.55) 24(0.75,-12.55) 25(1.25,-12.55) 26(1.75,-12.55) 27(2.25,-12.55) 28(2.75,-12.55) 29(3.25,-12.55) 30(3.75,-12.55) 31(4.25,-12.55) 32(4.75,-12.55) 33(5.25,-12.55) 34(5.75,-12.55) 35(6.25,-12.55) 36(6.75,-12.55) 37(7.25,-12.55) 38(7.75,-12.55) 39(8.25,-12.55) 40(8.75,-12.55) 41(9.25,-12.55) 42(9.75,-12.55) 43(10.25,-12.55) 44(10.75,-12.55) 89(10.75,12.55) 90(10.25,12.55) 91(9.75,12.55) 92(9.25,12.55) 93(8.75,12.55) 94(8.25,12.55) 95(7.75,12.55) 96(7.25,12.55) 97(6.75,12.55) 98(6.25,12.55) 99(5.75,12.55) 100(5.25,12.55) 101(4.75,12.55) 102(4.25,12.55) 103(3.75,12.55) 104(3.25,12.55) 105(2.75,12.55) 106(2.25,12.55) 107(1.75,12.55) 108(1.25,12.55) 109(0.75,12.55) 110(0.25,12.55) 111(-0.25,12.55) 112(-0.75,12.55) 113(-1.25,12.55) 114(-1.75,12.55) 115(-2.25,12.55) 116(-2.75,12.55) 117(-3.25,12.55) 118(-3.75,12.55) 119(-4.25,12.55) 120(-4.75,12.55) 121(-5.25,12.55) 122(-5.75,12.55) 123(-6.25,12.55) 124(-6.75,12.55) 125(-7.25,12.55) 126(-7.75,12.55) 127(-8.25,12.55) 128(-8.75,12.55) 129(-9.25,12.55) 130(-9.75,12.55) 131(-10.25,12.55) 132(-10.75,12.55)
  oval 1.8x0.28 smd: 45(12.55,-10.75) 46(12.55,-10.25) 47(12.55,-9.75) 48(12.55,-9.25) 49(12.55,-8.75) 50(12.55,-8.25) 51(12.55,-7.75) 52(12.55,-7.25) 53(12.55,-6.75) 54(12.55,-6.25) 55(12.55,-5.75) 56(12.55,-5.25) 57(12.55,-4.75) 58(12.55,-4.25) 59(12.55,-3.75) 60(12.55,-3.25) 61(12.55,-2.75) 62(12.55,-2.25) 63(12.55,-1.75) 64(12.55,-1.25) 65(12.55,-0.75) 66(12.55,-0.25) 67(12.55,0.25) 68(12.55,0.75) 69(12.55,1.25) 70(12.55,1.75) 71(12.55,2.25) 72(12.55,2.75) 73(12.55,3.25) 74(12.55,3.75) 75(12.55,4.25) 76(12.55,4.75) 77(12.55,5.25) 78(12.55,5.75) 79(12.55,6.25) 80(12.55,6.75) 81(12.55,7.25) 82(12.55,7.75) 83(12.55,8.25) 84(12.55,8.75) 85(12.55,9.25) 86(12.55,9.75) 87(12.55,10.25) 88(12.55,10.75) 133(-12.55,10.75) 134(-12.55,10.25) 135(-12.55,9.75) 136(-12.55,9.25) 137(-12.55,8.75) 138(-12.55,8.25) 139(-12.55,7.75) 140(-12.55,7.25) 141(-12.55,6.75) 142(-12.55,6.25) 143(-12.55,5.75) 144(-12.55,5.25) 145(-12.55,4.75) 146(-12.55,4.25) 147(-12.55,3.75) 148(-12.55,3.25) 149(-12.55,2.75) 150(-12.55,2.25) 151(-12.55,1.75) 152(-12.55,1.25) 153(-12.55,0.75) 154(-12.55,0.25) 155(-12.55,-0.25) 156(-12.55,-0.75) 157(-12.55,-1.25) 158(-12.55,-1.75) 159(-12.55,-2.25) 160(-12.55,-2.75) 161(-12.55,-3.25) 162(-12.55,-3.75) 163(-12.55,-4.25) 164(-12.55,-4.75) 165(-12.55,-5.25) 166(-12.55,-5.75) 167(-12.55,-6.25) 168(-12.55,-6.75) 169(-12.55,-7.25) 170(-12.55,-7.75) 171(-12.55,-8.25) 172(-12.55,-8.75) 173(-12.55,-9.25) 174(-12.55,-9.75) 175(-12.55,-10.25) 176(-12.55,-10.75)
Pad_e843
  custom 6.477x6.604 smd: 1(0,0)
Pad_e844
  custom 6.477x6.604 smd: 1(0,0)
Pad_e845
  custom 6.477x6.604 smd: 1(0,0)
Pad_e1565
  custom 6.477x6.604 smd: 1(0,0)
Pad_e1566
  custom 6.477x6.604 smd: 1(0,0)
Pad_e1567
  custom 6.477x6.604 smd: 1(0,0)
Pad_e1894
  custom 6.477x6.604 smd: 1(0,0)
Pad_e1895
  custom 6.477x6.604 smd: 1(0,0)
Pad_e1896
  custom 6.477x6.604 smd: 1(0,0)
Pad_e2490
  custom 6.604x6.477 smd: 1(0,0)
Pad_e2491
  custom 6.604x6.477 smd: 1(0,0)
Pad_e2492
  custom 6.604x6.477 smd: 1(0,0)
R0402
  rect 0.566x0.54 smd: 1(-0.433,0) 2(0.433,0)
R0603
  rect 0.806x0.864 smd: 1(-0.753,0) 2(0.753,0)
SOIC-8_L4.9-W3.9-P1.27-LS6.0-BL
  oval 0.588x2.045 smd: 1(-1.905,-2.57) 2(-0.635,-2.57) 3(0.635,-2.57) 4(1.905,-2.57) 5(1.905,2.57) 6(0.635,2.57) 7(-0.635,2.57) 8(-1.905,2.57)
SOT-23-3_L2.9-W1.6-P1.90-LS2.8-BR
  rect 1.07x0.6 smd: 1(1.235,-0.95) 2(1.235,0.95) 3(-1.235,0)
SOT-23-3_L3.0-W1.6-P1.90-LS2.8-BR
  rect 1.07x0.532 smd: 1(1.135,-0.95) 2(1.135,0.95) 3(-1.135,0)
SOT-223-4_L6.5-W3.5-P2.30-LS7.0-BR
  rect 2.47x0.98 smd: 1(2.835,-2.3) 2(2.835,0) 3(2.835,2.3)
  rect 2.47x3.6 smd: 4(-2.835,0)
SW-TH_SK12D07VG3
  oval 1.6x1.6 hole 1: 1(-2,0) 2(0,0) 3(2,0)
  oval 2x2.6 hole 1x1.4: 4(4.15,0) 5(-4.15,0)
TO-252-3_L6.6-W6.1-P4.57-LS9.9-BR-CW
  rect 2.5x1.2 smd: 1(3.475,-2.286) 3(3.475,2.286)
  rect 6.5x6 smd: 2(-3.475,0)
TSOT-23-6_L2.9-W1.6-P0.95-LS2.8-BL
  rect 0.55x1.2 smd: 1(-0.95,-1.2) 2(0,-1.2) 3(0.95,-1.2) 4(0.95,1.2) 5(0,1.2) 6(-0.95,1.2)
USB-C-SMD_KH-TYPE-C-16P
  oval 1x2 hole 0.6x1.7: 1(-4.32,1.765) 2(4.32,1.765)
  oval 1x1.8 hole 0.6x1.4: 3(-4.32,-2.415) 4(4.32,-2.415)
  rect 0.3x1.3 smd: A1(-3.35,2.415) A4(-2.55,2.415) A5(-1.25,2.415) A6(-0.25,2.415) A7(0.25,2.415) A8(1.25,2.415) A9(2.55,2.415) A12(3.35,2.415) B1(3.05,2.415) B4(2.25,2.415) B5(1.75,2.415) B6(0.75,2.415) B7(-0.75,2.415) B8(-1.75,2.415) B9(-2.25,2.415) B12(-3.05,2.415)

## Nets
1.2V: C108.2 FPC1.15 U29.2
2.8V: C109.2 FPC1.21 U30.2
3V3: C13.2 C22.2 C25.2 C27.2 C28.1 C29.1 C31.1 C40.2 C43.1 C52.1 C53.1 C61.2 C63.1 C66.2 C75.1 C77.2 C78.2 C79.2 C80.2 C81.2 C82.2 C83.2 C84.2 C85.2 C86.2 C87.2 C88.2 C90.2 C91.2 C94.1 C99.1 C100.2 C105.2 C106.1 C114.1 FPC1.14 L1.2 L2.2 L3.2 L4.1 L5.2 R2.1 R10.1 R11.1 R12.1 R34.1 R36.1 R57.1 R76.1 R78.1 R79.1 R80.1 SW1.3 SW2.3 SW3.3 SW4.3 SW5.3 U2.5 U2.8 U3.6 U3.8 U4.2 U4.4 U4.13 U8.6 U8.15 U8.23 U8.36 U8.49 U8.62 U8.72 U8.82 U8.91 U8.103 U8.114 U8.127 U8.136 U8.149 U8.159 U8.172 U9.1 U9.17 U15.1 U15.17 U18.1 U18.17 U23.1 U23.17 U25.3 U26.6 U26.15 U26.36 U26.49 U26.62 U26.72 U26.82 U26.91 U26.103 U26.127 U26.136 U26.149 U26.159 U26.172 U27.6 U27.8 U32.1
5V_USB: SW6.1 USB3.A4 USB3.A9 USB3.B4 USB3.B9
7.4V_BATTERY: C4.2 C5.2 C6.2 C36.2 C37.2 C38.2 C55.2 C57.2 C58.2 C59.2 C68.2 C70.2 C96.2 CN1.2 Q1.2 Q3.2 Q5.2 Q8.2 Q9.2 Q11.2 Q14.2 Q15.2 Q17.2 Q20.2 Q21.2 Q23.2 U1.1 U7.1 U10.1 U11.2 U11.3 U13.1 U14.1 U16.1 U17.1 U19.1 U20.1 U21.1 U22.1 U24.1
+5V: C1.2 C107.2 C110.2 H2.2 SW6.2 U25.1 U29.3 U30.3
GND: C1.1 C2.1 C3.2 C4.1 C5.1 C6.1 C8.1 C9.1 C10.1 C11.2 C12.2 C13.1 C22.1 C25.1 C27.1 C28.2 C29.2 C31.2 C34.2 C35.2 C36.1 C37.1 C38.1 C40.1 C43.2 C48.2 C49.2 C51.2 C52.2 C53.2 C55.1 C57.1 C58.1 C59.1 C61.1 C63.2 C66.1 C68.1 C70.1 C75.2 C77.1 C78.1 C79.1 C80.1 C81.1 C82.1 C83.1 C84.1 C85.1 C86.1 C87.1 C88.1 C89.2 C90.1 C91.1 C92.1 C93.1 C94.2 C96.1 C97.1 C98.1 C99.2 C100.1 C101.1 C102.1 C103.1 C105.1 C106.2 C107.1 C108.1 C109.1 C110.1 C112.2 C113.2 C114.2 CN1.1 CN1.3 CN1.4 FPC1.10 FPC1.23 FPC1.25 FPC1.26 H1.1 H2.1 H3.1 H4.1 H5.1 Q2.3 Q4.3 Q6.3 Q7.3 Q10.3 Q12.3 Q13.3 Q16.3 Q18.3 Q19.3 Q22.3 Q24.3 R4.1 R9.1 R15.1 R21.1 R24.1 R30.1 R33.2 R35.2 R41.1 R46.1 R47.1 R56.2 R58.1 R63.1 R64.1 R73.2 R74.2 R75.2 R77.1 R81.2 R82.1 SW1.4 SW1.5 SW2.4 SW2.5 SW3.4 SW3.5 SW4.4 SW4.5 SW5.4 SW5.5 SW6.4 SW6.5 U1.7 U2.6 U2.7 U2.9 U2.11 U3.1 U3.7 U4.9 U4.11 U7.7 U8.14 U8.22 U8.37 U8.61 U8.71 U8.90 U8.102 U8.113 U8.126 U8.135 U8.148 U8.158 U9.16 U9.32 U10.7 U11.4 U13.7 U14.7 U15.16 U15.32 U16.7 U17.7 U18.16 U18.32 U19.7 U20.7 U21.7 U22.7 U23.16 U23.32 U24.7 U25.2 U25.4 U26.14 U26.22 U26.37 U26.48 U26.61 U26.71 U26.90 U26.102 U26.113 U26.126 U26.135 U26.148 U26.158 U27.1 U27.10 U27.12 U29.1 U30.1 U31.2 U31.4 U32.8 U32.9 U32.10 USB3.1 USB3.2 USB3.3 USB3.4 USB3.A1 USB3.A12 USB3.B1 USB3.B12 X1.2 X1.4
VDDA: C92.2 C93.2 L4.2 U8.39 U26.39
$1I45090\$1N2344: Q5.1 R40.2
$1I45090\$1N2345: R40.1 U22.3
$1I45090\$1N2351: R37.1 U21.8
$1I45090\$1N2352: Q4.1 R37.2
$1I45090\$1N2355: C69.2 U21.2
$1I45090\$1N2357: R38.1 U21.3
$1I45090\$1N2360: R13.1 U20.8
$1I45090\$1N2365: Q3.1 R38.2
$1I45090\$1N2366: Q2.1 R13.2
$1I45090\$1N2369: C67.2 U20.2
$1I45090\$1N2370: R14.1 U20.3
$1I45090\$1N2372: Q1.1 R14.2
$1I45090\$1N2388: R36.2 U18.4
$1I45090\$1N2393: C71.2 U22.2
$1I45090\$1N2396: R39.1 U22.8
$1I45090\$1N2398: Q6.1 R39.2
$1I45090\$1N2406: C2.2 C89.1 L3.1 U18.5
$1I45090\A_REF: R20.1 R23.1 R29.1 U18.9
$1I45090\AU: R19.1 R20.2 R21.2 U18.6
$1I45090\AV: R22.1 R23.2 R24.2 U18.7
$1I45090\AW: R28.1 R29.2 R30.2 U18.8
$1I45090\BOOT0_ESC: R35.1 SW3.2 U18.31
$1I45090\PHASE_U: C67.1 NOREF#11.1 Q1.3 Q2.2 R19.2 U20.4
$1I45090\PHASE_V: C69.1 NOREF.1 Q3.3 Q4.2 R22.2 U21.4
$1I45090\PHASE_W: C71.1 NOREF#4.1 Q5.3 Q6.2 R28.2 U22.4
$1I45090\UH: U18.11 U20.5
$1I45090\UL: U18.10 U20.6
$1I45090\USART1_RX: H1.3 U18.20
$1I45090\USART1_TX: H1.2 U18.19
$1I45090\VH: U18.13 U21.5
$1I45090\VL: U18.12 U21.6
$1I45090\WH: U18.15 U22.5
$1I45090\WL: U18.14 U22.6
$1I45112\$1N2344: Q8.1 R18.2
$1I45112\$1N2345: R18.1 U1.3
$1I45112\$1N2351: R25.1 U10.8
$1I45112\$1N2352: Q7.1 R25.2
$1I45112\$1N2355: C24.2 U10.2
$1I45112\$1N2357: R31.1 U10.3
$1I45112\$1N2360: R27.1 U7.8
$1I45112\$1N2365: Q9.1 R31.2
$1I45112\$1N2366: Q10.1 R27.2
$1I45112\$1N2369: C7.2 U7.2
$1I45112\$1N2370: R32.1 U7.3
$1I45112\$1N2372: Q11.1 R32.2
$1I45112\$1N2388: R2.2 U9.4
$1I45112\$1N2393: C32.2 U1.2
$1I45112\$1N2396: R26.1 U1.8
$1I45112\$1N2398: Q12.1 R26.2
$1I45112\$1N2406: C3.1 C8.2 L1.1 U9.5
$1I45112\A_REF: R5.1 R16.1 R17.1 U9.9
$1I45112\AU: R8.1 R15.2 R17.2 U9.6
$1I45112\AV: R7.1 R9.2 R16.2 U9.7
$1I45112\AW: R4.2 R5.2 R6.1 U9.8
$1I45112\BOOT0_ESC: R33.1 SW2.2 U9.31
$1I45112\PHASE_U: C7.1 NOREF#3.1 Q10.2 Q11.3 R8.2 U7.4
$1I45112\PHASE_V: C24.1 NOREF#7.1 Q7.2 Q9.3 R7.2 U10.4
$1I45112\PHASE_W: C32.1 NOREF#2.1 Q8.3 Q12.2 R6.2 U1.4
$1I45112\UH: U7.5 U9.11
$1I45112\UL: U7.6 U9.10
$1I45112\USART1_RX: H3.3 U9.20
$1I45112\USART1_TX: H3.2 U9.19
$1I45112\VH: U9.13 U10.5
$1I45112\VL: U9.12 U10.6
$1I45112\WH: U1.5 U9.15
$1I45112\WL: U1.6 U9.14
$1I45134\$1N2344: Q14.1 R50.2
$1I45134\$1N2345: R50.1 U13.3
$1I45134\$1N2351: R51.1 U16.8
$1I45134\$1N2352: Q13.1 R51.2
$1I45134\$1N2355: C41.2 U16.2
$1I45134\$1N2357: R54.1 U16.3
$1I45134\$1N2360: R53.1 U14.8
$1I45134\$1N2365: Q15.1 R54.2
$1I45134\$1N2366: Q16.1 R53.2
$1I45134\$1N2369: C39.2 U14.2
$1I45134\$1N2370: R55.1 U14.3
$1I45134\$1N2372: Q17.1 R55.2
$1I45134\$1N2388: R34.2 U15.4
$1I45134\$1N2393: C54.2 U13.2
$1I45134\$1N2396: R52.1 U13.8
$1I45134\$1N2398: Q18.1 R52.2
$1I45134\$1N2406: C9.2 C11.1 L2.1 U15.5
$1I45134\A_REF: R42.1 R48.1 R49.1 U15.9
$1I45134\AU: R45.1 R47.2 R49.2 U15.6
$1I45134\AV: R44.1 R46.2 R48.2 U15.7
$1I45134\AW: R41.2 R42.2 R43.1 U15.8
$1I45134\BOOT0_ESC: R56.1 SW4.2 U15.31
$1I45134\PHASE_U: C39.1 NOREF#6.1 Q16.2 Q17.3 R45.2 U14.4
$1I45134\PHASE_V: C41.1 NOREF#9.1 Q13.2 Q15.3 R44.2 U16.4
$1I45134\PHASE_W: C54.1 NOREF#12.1 Q14.3 Q18.2 R43.2 U13.4
$1I45134\UH: U14.5 U15.11
$1I45134\UL: U14.6 U15.10
$1I45134\USART1_RX: H4.3 U15.20
$1I45134\USART1_TX: H4.2 U15.19
$1I45134\VH: U15.13 U16.5
$1I45134\VL: U15.12 U16.6
$1I45134\WH: U13.5 U15.15
$1I45134\WL: U13.6 U15.14
$1I45156\$1N2344: Q20.1 R67.2
$1I45156\$1N2345: R67.1 U17.3
$1I45156\$1N2351: R68.1 U24.8
$1I45156\$1N2352: Q19.1 R68.2
$1I45156\$1N2355: C62.2 U24.2
$1I45156\$1N2357: R71.1 U24.3
$1I45156\$1N2360: R70.1 U19.8
$1I45156\$1N2365: Q21.1 R71.2
$1I45156\$1N2366: Q22.1 R70.2
$1I45156\$1N2369: C60.2 U19.2
$1I45156\$1N2370: R72.1 U19.3
$1I45156\$1N2372: Q23.1 R72.2
$1I45156\$1N2388: R57.2 U23.4
$1I45156\$1N2393: C76.2 U17.2
$1I45156\$1N2396: R69.1 U17.8
$1I45156\$1N2398: Q24.1 R69.2
$1I45156\$1N2406: C10.2 C12.1 L5.1 U23.5
$1I45156\A_REF: R59.1 R65.1 R66.1 U23.9
$1I45156\AU: R62.1 R64.2 R66.2 U23.6
$1I45156\AV: R61.1 R63.2 R65.2 U23.7
$1I45156\AW: R58.2 R59.2 R60.1 U23.8
$1I45156\BOOT0_ESC: R73.1 SW5.2 U23.31
$1I45156\PHASE_U: C60.1 NOREF#10.1 Q22.2 Q23.3 R62.2 U19.4
$1I45156\PHASE_V: C62.1 NOREF#8.1 Q19.2 Q21.3 R61.2 U24.4
$1I45156\PHASE_W: C76.1 NOREF#5.1 Q20.3 Q24.2 R60.2 U17.4
$1I45156\UH: U19.5 U23.11
$1I45156\UL: U19.6 U23.10
$1I45156\USART1_RX: H5.3 U23.20
$1I45156\USART1_TX: H5.2 U23.19
$1I45156\VH: U23.13 U24.5
$1I45156\VL: U23.12 U24.6
$1I45156\WH: U17.5 U23.15
$1I45156\WL: U17.6 U23.14
BOOT0: R75.1 SW1.2 U8.166 U26.166
BOOT1: R74.1 U8.58 U26.58
CAM_RST: FPC1.19 R78.2
CAM_XCLK: FPC1.12 U8.5
DCMI_0: FPC1.6 U8.86
DCMI_1: FPC1.4 U8.87
DCMI_2: FPC1.3 U8.88
DCMI_3: FPC1.5 U8.89
DCMI_4: FPC1.7 U8.129
DCMI_5: FPC1.9 U8.173
DCMI_6: FPC1.11 U8.175
DCMI_7: FPC1.13 U8.176
DCMI_8: U8.132
DCMI_9: U8.133
DCMI_10: U8.134
DCMI_11: U8.130
DCMI_12: U8.59
DCMI_13: U8.131
DCMI_HSYNC: FPC1.16 U8.85
DCMI_PXLCLK: C103.2 FPC1.8 U8.52
DCMI_VSYNC: FPC1.18 U8.174
DM: U8.122 U26.122 USB3.A7 USB3.B7
DP: U8.123 U26.123 USB3.A6 USB3.B6
E01_CE: U32.2
E01_IRQ: U32.7
GPS_RX_MCU_TX: U8.79 U26.79 U27.3
GPS_TX_MCU_RX: U8.80 U26.80 U27.2
I2C1_SCLK: R12.2 U4.1 U8.164 U26.164
I2C1_SDA: R11.2 U4.16 U8.165 U26.165
I2C2_SCLK: FPC1.20 R80.2 U8.17 U26.17
I2C2_SDA: FPC1.22 R79.2 U8.16 U26.16
IMU_INT: U2.4
MOTOR1: H1.4 U8.56 U18.30 U26.56
MOTOR2: H3.4 U8.57 U9.30 U26.57
MOTOR3: H5.4 U8.42 U23.30 U26.42
MOTOR4: H4.4 U8.47 U15.30 U26.47
RADIO_RX: H2.4 U8.121 U26.121
RADIO_TX: H2.3 U8.120 U26.120
SPI1_CS: U8.153 U26.153 U32.3
SPI1_MISO: U8.152 U26.152 U32.6
SPI1_MOSI: U8.151 U26.151 U32.5
SPI1_SCLK: U8.154 U26.154 U32.4
SPI2_CS: U3.2 U8.95 U26.95
SPI2_MISO: U3.5 U8.93 U26.93
SPI2_MOSI: U3.3 U8.92 U26.92
SPI2_SCLK: U3.4 U8.94 U26.94
SPI3_CS: U2.12 U8.138
SPI3_MISO: U2.1 U8.140 U26.140
SPI3_MOSI: U2.14 U8.141 U26.141
SPI3_SCLK: U2.13 U8.139 U26.139
XI: C35.1 U8.29 X1.3
XI_HS: C113.1 U26.29 U31.3
XO: C34.1 U8.30 X1.1
XO_HS: C112.1 U26.30 U31.1
$1N17368: C97.2 C98.2 L6.2 SW6.3 U11.1
$1N17546: C95.1 L6.1 U11.5
$1N17973: R10.2 U8.31
$1N17975: C49.1 U8.81
$1N17977: C48.1 U8.125
$1N18305: C50.2 U4.12
$1N18391: C51.1 U4.10
$1N18545: C50.1 U4.8
$1N56559: C95.2 U11.6
$1N79325: L7.2 L8.1 U27.11
$1N79329: L7.1 U27.14
$1N80218: R76.2 U26.31
$1N80254: C101.2 U26.125
$1N80328: C102.2 U26.81
$1N81168: FPC1.17 R77.2
$1N85586: R81.1 USB3.B5
$1N85625: R82.2 USB3.A5

Pads without a net: FPC1 1 2 24; SW1 1; SW2 1; SW3 1; SW4 1; SW5 1; U2 2 3 10; U4 3 5 6 7 14 15; U8 1 2 3 4 7 8 9 10 11 12 13 18 19 20 21 24 25 26 27 28 32 33 34 35 38 40 41 43 44 45 46 48 50 51 53 54 55 60 63 64 65 66 67 68 69 70 73 74 75 76 77 78 83 84 96 97 98 99 100 101 104 105 106 107 108 109 110 111 112 115 116 117 118 119 124 128 137 142 143 144 145 146 147 150 155 156 157 160 161 162 163 167 168 169 170 171; U9 2 3 18 21 22 23 24 25 26 27 28 29; U15 2 3 18 21 22 23 24 25 26 27 28 29; U18 2 3 18 21 22 23 24 25 26 27 28 29; U23 2 3 18 21 22 23 24 25 26 27 28 29; U26 1 2 3 4 5 7 8 9 10 11 12 13 18 19 20 21 23 24 25 26 27 28 32 33 34 35 38 40 41 43 44 45 46 50 51 52 53 54 55 59 60 63 64 65 66 67 68 69 70 73 74 75 76 77 78 83 84 85 86 87 88 89 96 97 98 99 100 101 104 105 106 107 108 109 110 111 112 114 115 116 117 118 119 124 128 129 130 131 132 133 134 137 138 142 143 144 145 146 147 150 155 156 157 160 161 162 163 167 168 169 170 171 173 174 175 176; U27 4 5 7 9 13 15 16 17 18; USB3 A8 B8

## Via types
v1: diameter 0.61, hole 0.305, Top Layer to Bottom Layer, 260 vias

## Routing (per net, layer and track width the routed paths; a pad name or vN(x,y) marks a point on that pad's centre or on a via; arc(x,y) is an arc through that point)
3V3: length 140.4
  Top Layer w0.254: v1(215.14,120.9) 215.1,120.94 C27.2 215.4,122.29 U2.5 ; v1(219.2,102.49) 219.29,102.58 219.96,102.58 220.41,102.09 U8.172 ; v1(219.46,119.25) 219.99,119.78 C77.2 220.15,120.09 U8.136 ; v1(219.96,112.52) 219.96,113.3 C81.2 220.25,113.59 U8.149 ; v1(219.96,107.57) C85.2 220.13,108.59 U8.159 ; U8.6 225.89,96.94 v1(225.93,96.9) ; v1(231.54,124.97) C78.2 232.39,124.82 U8.114 ; U8.23 234.39,96.86 C91.2 v1(235.33,96.65) ; v1(236.91,124.97) C82.2 237.89,124.78 U8.103 ; v1(239.27,95.38) 239.26,95.39 R10.1 239.55,96.69 C87.2 240.89,96.91 U8.36 ; v1(240.77,93.97) 241.76,93.97 L4.1 ; v1(243.19,125.73) 243.8,125.12 C84.2 243.89,124.88 U8.91 ; U8.82 248.27,118.59 ; 248.27,118.59 248.27,119.24 v1(248.28,119.25) ; 248.27,118.59 C90.2 ; U8.72 248.14,113.59 C79.2 v1(248.33,114.52) ; U8.62 248.09,108.59 C83.2 v1(248.33,109.6) ; U8.49 248.27,102.09 ; 248.27,102.09 248.27,102.86 v1(248.28,102.87) ; 248.27,102.09 C88.2 ; U4.2 217.75,115.96 C52.1 ; U2.8 218.26,123.71 C106.1 ; U4.13 214.9,113.74 C53.1 214.69,114.11 v1(214.25,114.55) ; U4.4 217.88,116.96 C52.1 ; C52.1 218.95,115.89 v1(218.95,115.52) ; C80.2 225.89,124.97 U8.127 ; U3.8 243.41,129.81 C29.1 243.76,130.23 v1(242.81,131.18) 241.99,130.36 C28.1 242.11,130.05 U3.6 ; U8.15 230.39,96.8 C13.2 230.58,96.61 v1(231.27,96.61)
  Top Layer w0.635: C106.1 219.74,123.66 C25.2 219.84,122.81 v1(219.78,122.76)
  Bottom Layer w0.508: SW4.3 270.22,108.24 271.14,107.31 271.14,105.03 270.44,104.33 v1(269.23,104.33) 268.86,103.95 268.86,103.58 ; 384.81,120.85 384.4,121.26 R36.1 382.09,121.26 U18.1 382.45,121.67 C63.1 ; 384.81,120.85 L3.2 ; 384.81,120.85 384.81,121.23 v1(385.18,121.6) 386.39,121.6 387.1,122.3 387.1,124.59 386.17,125.51 SW3.3 ; U9.17 35.3,113.75 C22.2 34.42,112.32 v1(34.42,111.25) ; 158.65,105.3 158.65,105.67 v1(159.02,106.05) 160.24,106.05 160.94,106.75 160.94,109.03 160.02,109.96 SW5.3 ; 158.65,105.3 L5.2 ; 158.65,105.3 158.24,105.71 R57.1 155.94,105.71 U23.1 156.29,106.12 C75.1 ; v1(144.92,99.82) 145.99,99.82 C61.2 147.43,98.94 U23.17 ; 28.94,124.98 28.56,124.98 v1(28.19,125.35) 28.19,126.56 27.49,127.27 25.2,127.27 24.28,126.35 SW2.3 ; 28.94,124.98 L1.2 ; 28.94,124.98 28.53,124.57 R2.1 28.53,122.27 U9.1 28.12,122.62 C31.1 ; U18.17 373.58,114.49 C66.2 372.15,115.37 v1(371.08,115.37) ; 268.86,103.58 268.44,103.99 R34.1 266.14,103.99 U15.1 266.5,104.4 C43.1 ; 268.86,103.58 L2.2 ; v1(255.13,98.1) 256.2,98.1 C40.2 257.63,97.22 257.63,98.42
  Bottom Layer w0.635: U27.8 230.16,120.49 230.48,120.81 v1(231.31,120.81) 231.73,120.81 232.36,121.44 U27.6
  Bottom Layer w1.27: C99.1 211.65,51.64 v1(212.07,52.05) v1(212.66,52.65)
  Bottom Layer w1.524: C99.1 208.26,51.64 207.72,52.18
7.4V_BATTERY: length 226
  Top Layer w6.35: 47.33,128.52 47.33,105.36 ; 162.19,86.91 139.04,86.91 ; 272.39,85.19 249.24,85.19 ; 388.35,102.47 365.19,102.47
  Bottom Layer w0.635: 181.57,83.48 181.57,84.26 182.36,84.26 182.36,83.48 ; U11.2 U11.3
  Bottom Layer w1.016: v1(368.95,102.47) 362.86,102.47 361.33,100.94 C70.2 363.08,98.29 U22.1 ; U14.1 270.75,81.02 C37.2 269,84.81 v1(268.62,85.19) ; v1(47.33,120.94) 47.33,114.84 48.85,113.32 C6.2 51.5,115.06 U10.1 ; U17.1 136.92,82.74 C57.2 135.18,85.39 136.7,86.91 v1(142.8,86.91) ; v1(380.76,102.47) 374.67,102.47 373.14,100.94 C68.2 374.89,98.29 U21.1 ; v1(47.33,124.75) 47.71,125.13 C5.2 51.5,126.87 U7.1 ; U20.1 386.7,98.29 C55.2 384.96,102.09 v1(384.57,102.47) ; U13.1 247.13,81.02 C36.2 245.38,83.67 246.91,85.19 v1(253,85.19) ; v1(47.33,109.12) 47.33,103.03 48.85,101.5 C4.2 51.5,103.25 U1.1 ; U24.1 148.73,82.74 C59.2 146.99,85.39 148.51,86.91 v1(154.61,86.91) ; v1(158.42,86.91) 158.8,86.53 C58.2 160.54,82.74 U19.1 ; U16.1 258.94,81.02 C38.2 257.19,83.67 258.72,85.19 v1(264.81,85.19)
  Bottom Layer w1.27: U11.3 181.92,86.8 183.13,88.01
+5V: length 7.2
  Top Layer w0.508: C110.2 202.9,165.06 U30.3 ; U29.3 206.32,165.19 C107.2
  Bottom Layer w1.016: C1.2 200.66,50.14 U25.1
GND: length 266.1
  Top Layer w0.254: U2.6 215.9,122.6 217.34,121.16 v1(217.55,121.16) ; U2.7 216.5,123.34 C27.1 ; R75.2 219.03,104.7 219.46,104.27 v1(219.96,104.27) C86.1 ; v1(219.23,120.81) 219.28,120.76 C77.1 220.16,120.59 U8.135 ; v1(219.97,110.07) 219.97,109.26 219.96,109.26 220.14,109.09 U8.158 ; v1(219.96,114.94) 219.99,114.91 C81.1 220.06,114.09 U8.148 ; U8.113 232.89,124.78 C78.1 v1(233.81,124.97) ; v1(233.05,96.65) C91.1 233.89,96.77 U8.22 ; U8.102 238.39,124.82 C82.1 v1(239.25,124.97) ; C87.1 240.77,95.95 241.32,95.95 ; U8.37 241.39,96.9 C92.1 241.32,96.07 241.32,95.84 241.77,95.39 C93.1 ; U8.90 244.39,124.72 C84.1 244.64,125.64 v1(244.73,125.73) ; U8.71 248.19,113.09 C79.1 v1(248.33,112.16) ; U8.61 248.23,108.09 C83.1 249.01,107.98 v1(249.17,107.82) 249.22,107.77 249.22,106.76 ; C88.1 v1(249.89,102.05) ; C90.1 250,117.7 C49.2 ; C51.2 213.29,118.05 v1(213.89,117.44) U4.9 ; C53.2 213.3,114.87 v1(213.59,115.16) 213.88,115.45 213.88,115.7 214.04,115.86 214.29,115.86 U4.11 ; v1(242.78,129.35) 242.76,129.33 U3.7 ; v1(229.68,95.83) 229.7,95.86 C13.1 229.89,96.84 U8.14 ; C80.1 v1(225.96,126.81) C48.2 ; C29.2 245.16,128.45 v1(244.72,128) 243.87,127.15 U3.1 ; C28.2 240.59,131.24 v1(240.61,131.25) ; U8.126 v1(226.39,121.64) ; U2.9 218.02,124.21 C106.2 219.18,124.5 C25.1 219.79,125.21 U2.11
  Top Layer w0.889: USB3.A1 225.17,90.16 USB3.1 ; USB3.2 232.51,90.16 USB3.A12
  Top Layer w1.143: Q12.3 61.83,98.76 v1(61,99.59) ; v1(156.88,73.24) 156.05,72.41 Q22.3 ; Q7.3 61.83,110.57 v1(61,111.4) ; v1(371.23,88.79) 370.4,87.96 Q4.3 ; Q6.3 358.59,87.96 v1(359.42,88.79) ; Q24.3 132.43,72.41 v1(133.26,73.24) ; v1(61,123.21) 61.83,122.38 Q10.3 ; Q13.3 254.45,70.69 v1(255.28,71.52) ; v1(243.47,71.52) 242.64,70.69 Q18.3 ; Q16.3 266.26,70.69 v1(267.09,71.52) ; Q2.3 382.21,87.96 v1(383.04,88.79) ; v1(145.07,73.24) 144.24,72.41 Q19.3
  Bottom Layer w0.254: C35.2 235.78,101.66 235.96,101.49 ; X1.4 238.28,103.06 C34.2
  Bottom Layer w0.508: U15.32 v1(265.42,106.2) 265.94,106.72 C43.2 ; 270.21,100.82 270.24,100.8 v1(270.24,100.13) ; 270.21,100.82 269.58,100.82 ; 270.21,100.82 270.72,100.82 C9.1 ; R35.2 382.02,124.43 C63.2 ; 386.17,118.1 386.67,118.1 C2.1 ; 386.17,118.1 C89.2 ; 386.17,118.1 386.19,118.07 v1(386.19,117.41) ; v1(160.04,101.85) 160.04,102.52 160.01,102.55 ; C63.2 381.89,124 v1(381.37,123.47) U18.32 ; C63.2 384.55,124 SW3.4 ; C43.2 266.06,107.16 R56.2 ; C43.2 268.6,106.72 SW4.4 ; C75.2 158.4,108.44 SW5.4 ; C75.2 155.73,108.44 v1(155.21,107.92) U23.32 ; C75.2 155.86,108.88 R73.2 ; C8.1 31.69,126.84 31.69,126.34 ; H4.1 254.5,95.55 C40.1 258.28,95.55 259.07,96.34 U15.16 ; C12.2 160.01,102.55 ; 160.01,102.55 160.52,102.55 C10.1 ; C31.2 25.79,122.06 v1(26.32,121.54) U9.32 ; C31.2 25.36,122.19 R33.2 ; C31.2 25.79,124.72 SW2.4 ; H1.1 370.45,112.82 C66.1 374.23,112.82 375.02,113.61 375.02,114.25 ; v1(32.38,126.37) 31.72,126.37 31.69,126.34 ; H5.1 144.29,97.27 C61.1 148.07,97.27 148.87,98.06 148.87,98.7 ; U9.16 36.18,115.2 36.97,114.4 C22.1 36.97,110.62 H3.1 ; 31.69,126.34 31.69,125.7
  Bottom Layer w0.635: U10.7 55.95,116.36 C6.1 v1(53.98,113.32) ; v1(361.33,95.82) C70.1 364.38,93.85 U22.7 ; v1(373.14,95.82) C68.1 376.19,93.85 U21.7 ; U20.7 388,93.85 C55.1 v1(384.96,95.82) ; v1(227.5,120.94) 228.19,120.94 C100.1 ; U16.7 260.24,76.57 C38.1 v1(257.19,78.54) ; v1(53.98,125.13) C5.1 55.95,128.18 56.67,128.18 ; U14.7 272.05,76.57 C37.1 v1(269,78.54) ; v1(245.38,78.54) C36.1 248.43,76.57 U13.7 ; 56.67,104.55 55.95,104.55 C4.1 v1(53.98,101.5) ; v1(238.29,121.19) 238.29,121.92 U27.1 ; U11.4 v1(184.32,85.25) ; v1(158.8,80.26) C58.1 161.85,78.29 U19.7 ; v1(146.99,80.26) C59.1 150.04,78.29 U24.7 ; U27.12 231.27,131.05 230.67,130.46 229.53,130.46 229.06,130.92 U27.10 ; U17.7 138.23,78.29 C57.1 v1(135.18,80.26)
  Bottom Layer w0.762: 180.32,80.66 180.32,78.9
  Bottom Layer w1.016: R82.1 224.52,88.79 USB3.1 ; R81.2 233.16,88.27 USB3.2
  Bottom Layer w1.143: R24.1 v1(379.34,106.98) ; R47.1 v1(275.2,89.71) ; R64.1 v1(164.99,91.43) ; R41.1 v1(251.57,89.71) ; R21.1 v1(391.15,106.98) ; R4.1 v1(42.81,107.7) ; R30.1 v1(367.52,106.98) ; R15.1 v1(42.81,131.32) ; R46.1 v1(263.38,89.71) ; R58.1 v1(141.37,91.43) ; R9.1 v1(42.81,119.51) ; R63.1 v1(153.18,91.43)
  Bottom Layer w1.524: U25.2 v1(204.99,49.33) U25.4 205.92,47.43 v1(208.17,47.43) 209.1,47.43 C99.2
  vias: v1(180.32,79.89) v1(218.82,125.22) v1(230.17,128.81) v1(234.77,101.68) v1(239.28,103.06) v1(241.36,95.89) v1(249.71,117.98)
$1I45090\$1N2344: length 2.1
  Top Layer w0.762: Q5.1 363.39,94.81 R40.2
$1I45090\$1N2345: length 2.8
  Top Layer w0.762: v1(365.52,96.71) 365.13,96.32 R40.1
  Bottom Layer w0.762: U22.3 365.65,96.83 v1(365.52,96.71)
$1I45090\$1N2351: length 2.6
  Bottom Layer w0.762: U21.8 374.06,92.26 R37.1
$1I45090\$1N2352: length 3.2
  Top Layer w0.762: 370.37,92.08 370.37,92.06 v1(371.54,90.89)
  Bottom Layer w0.762: v1(371.54,90.89) 371.22,91.22 R37.2
$1I45090\$1N2355: length 2.5
  Bottom Layer w0.508: C69.2 376.19,99.82 U21.2
$1I45090\$1N2357: length 2.8
  Top Layer w0.762: v1(377.34,96.71) 376.95,96.32 R38.1
  Bottom Layer w0.762: v1(377.34,96.71) 377.46,96.83 U21.3
$1I45090\$1N2360: length 2.6
  Bottom Layer w0.762: U20.8 385.87,92.26 R13.1
$1I45090\$1N2365: length 2.1
  Top Layer w0.762: Q3.1 375.2,94.81 R38.2
$1I45090\$1N2366: length 3.2
  Top Layer w0.762: 382.18,92.08 382.18,92.06 v1(383.35,90.89)
  Bottom Layer w0.762: v1(383.35,90.89) 383.03,91.22 R13.2
$1I45090\$1N2369: length 2.5
  Bottom Layer w0.508: U20.2 388,99.82 C67.2
$1I45090\$1N2370: length 2.8
  Top Layer w0.762: v1(389.15,96.71) 388.76,96.32 R14.1
  Bottom Layer w0.762: v1(389.15,96.71) 389.27,96.83 U20.3
$1I45090\$1N2372: length 2.1
  Top Layer w0.762: R14.2 387.01,94.81 Q1.1
$1I45090\$1N2388: length 2.3
  Bottom Layer w0.508: U18.4 383.1,118.89 R36.2
$1I45090\$1N2393: length 2.5
  Bottom Layer w0.508: U22.2 364.38,99.82 C71.2
$1I45090\$1N2396: length 2.6
  Bottom Layer w0.762: U22.8 362.25,92.26 R39.1
$1I45090\$1N2398: length 3.2
  Top Layer w0.762: v1(359.73,90.89) 358.56,92.06 358.56,92.08
  Bottom Layer w0.762: 359.4,92.26 359.4,91.22 v1(359.73,90.89)
$1I45090\$1N2406: length 5.8
  Bottom Layer w0.508: U18.5 382.07,118.1 C89.1 384.69,118.78 L3.1 386.33,119.45 C2.2
$1I45090\A_REF: length 31.7
  Power w1.016: v1(371.42,110.84) 374.72,114.15 380.94,114.15 v1(381.88,113.22) 382.64,113.22 v1(384.51,111.34) v1(387.04,108.81)
  Bottom Layer w0.508: v1(381.88,113.22) 381.66,113.22 380.62,114.25
  Bottom Layer w1.016: v1(384.51,111.34) 382.21,109.05 R23.1 ; R29.1 370.45,109.87 v1(371.42,110.84) ; R20.1 387.04,108 v1(387.04,108.81)
$1I45090\AU: length 26.2
  Bottom Layer w0.508: U18.6 383.9,117.29 392.66,108.52 v1(392.66,105.35)
  Bottom Layer w1.016: R20.2 R21.2 391.52,104.21 v1(392.66,105.35) 392.67,105.36 R19.1
$1I45090\AV: length 24.5
  Bottom Layer w0.508: v1(382.28,106.78) 385.9,110.4 385.9,113.89 383.3,116.49 U18.7
  Bottom Layer w1.016: R24.2 379.71,104.21 v1(382.28,106.78) 382.28,101.8 R22.1
$1I45090\AW: length 30.4
  Bottom Layer w0.508: U18.8 382.7,115.69 383.36,115.04 383.36,112.37 379.76,108.77 372.46,108.77 v1(370.44,106.75)
  Bottom Layer w1.016: R30.2 367.9,104.21 v1(370.44,106.75) 370.44,101.77 R28.1
$1I45090\BOOT0_ESC: length 8.9
  Bottom Layer w0.508: U18.31 379.82,125.32 381.63,127.12 R35.1 382.41,127.51 SW3.2
$1I45090\PHASE_U: length 20.1
  Top Layer w2.032: 390.88,92.45 Q1.3 390.88,95.64 v1(392.19,96.96)
  Top Layer w6.35: Q2.2 389.16,81.64 NOREF#11.1
  Bottom Layer w0.508: U20.4 390.54,100.07 C67.1
  Bottom Layer w1.016: U20.4 390.89,98.26 v1(392.19,96.96)
  Bottom Layer w1.143: R19.2 392.67,97.44 v1(392.19,96.96)
$1I45090\PHASE_V: length 20.1
  Top Layer w2.032: v1(380.38,96.96) 379.06,95.64 Q3.3 379.06,92.45
  Top Layer w6.35: Q4.2 377.35,81.61 NOREF.1
  Bottom Layer w0.508: C69.1 378.73,100.07 U21.4
  Bottom Layer w1.016: U21.4 379.08,98.26 v1(380.38,96.96)
  Bottom Layer w1.143: R22.2 380.86,97.44 v1(380.38,96.96)
$1I45090\PHASE_W: length 20.1
  Top Layer w2.032: v1(368.57,96.96) 367.25,95.64 Q5.3 367.25,92.45
  Top Layer w6.35: Q6.2 365.54,81.64 NOREF#4.1
  Bottom Layer w0.508: C71.1 366.92,100.07 U22.4
  Bottom Layer w1.016: U22.4 367.27,98.26 v1(368.57,96.96)
  Bottom Layer w1.143: v1(368.57,96.96) 369.05,97.44 R28.2
$1I45090\UH: length 35
  Power w0.508: 379.03,112.25 380.08,112.25 393.85,98.48 393.85,90.74
  Bottom Layer w0.508: 379.02,114.25 379.02,112.28 v1(379,112.25) ; U20.5 390.54,92.36 392.16,90.74 v1(393.81,90.74)
$1I45090\UL: length 36.1
  Power w0.508: 380,110.6 392.97,97.64 392.97,89.72 393.09,89.59
  Bottom Layer w0.508: v1(379.97,110.6) 379.82,110.75 379.82,114.25 ; U20.6 389.27,91.85 391.53,89.59 v1(393.06,89.59)
$1I45090\USART1_RX: length 4.8
  Bottom Layer w0.508: H1.3 370.26,118.09 U18.20
$1I45090\USART1_TX: length 4.6
  Bottom Layer w0.508: U18.19 369.95,117.29 H1.2
$1I45090\VH: length 29.1
  Power w0.508: 381.27,90.74 381.27,98.53 377.38,102.42 377.38,112.25
  Bottom Layer w0.508: v1(377.35,112.25) 377.42,112.32 377.42,114.25 ; U21.5 378.73,92.36 380.35,90.74 v1(381.24,90.74)
$1I45090\VL: length 33
  Power w0.508: 378.28,110.6 378.28,103.63 382.04,99.87 382.04,89.59
  Bottom Layer w0.508: v1(378.25,110.6) 378.22,110.63 378.22,114.25 ; U21.6 377.46,91.85 379.72,89.59 v1(382.01,89.59)
$1I45090\WH: length 30.1
  Power w0.508: 369.46,90.74 369.46,95.94 374.67,101.15 374.67,111.38 375.54,112.25
  Bottom Layer w0.508: v1(375.51,112.25) 375.58,112.25 375.82,112.49 375.82,114.25 ; v1(369.43,90.74) 368.54,90.74 366.92,92.36 U22.5
$1I45090\WL: length 34.1
  Power w0.508: 370.23,89.59 370.23,95.19 376.5,101.45 376.5,110.6
  Bottom Layer w0.508: U22.6 365.65,91.85 367.91,89.59 v1(370.2,89.59) ; v1(376.46,110.6) 376.62,110.76 376.62,114.25
$1I45112\$1N2344: length 2.1
  Top Layer w0.762: R18.2 54.98,103.56 Q8.1
$1I45112\$1N2345: length 2.8
  Top Layer w0.762: R18.1 53.48,105.31 v1(53.09,105.7)
  Bottom Layer w0.762: v1(53.09,105.7) 52.96,105.82 U1.3
$1I45112\$1N2351: length 2.6
  Bottom Layer w0.762: U10.8 57.53,114.24 R25.1
$1I45112\$1N2352: length 3.2
  Top Layer w0.762: v1(58.9,111.71) 57.73,110.54 57.71,110.54
  Bottom Layer w0.762: R25.2 58.57,111.39 v1(58.9,111.71)
$1I45112\$1N2355: length 2.5
  Bottom Layer w0.508: C24.2 49.97,116.36 U10.2
$1I45112\$1N2357: length 2.8
  Top Layer w0.762: R31.1 53.48,117.12 v1(53.09,117.51)
  Bottom Layer w0.762: v1(53.09,117.51) 52.96,117.63 U10.3
$1I45112\$1N2360: length 2.6
  Bottom Layer w0.762: U7.8 57.53,126.05 R27.1
$1I45112\$1N2365: length 2.1
  Top Layer w0.762: Q9.1 54.98,115.37 R31.2
$1I45112\$1N2366: length 3.2
  Top Layer w0.762: v1(58.9,123.53) 57.73,122.35 57.71,122.35
  Bottom Layer w0.762: v1(58.9,123.53) 58.57,123.2 R27.2
$1I45112\$1N2369: length 2.5
  Bottom Layer w0.508: C7.2 49.97,128.18 51.53,128.18
$1I45112\$1N2370: length 2.8
  Top Layer w0.762: R32.1 53.48,128.93 v1(53.09,129.32)
  Bottom Layer w0.762: v1(53.09,129.32) 52.96,129.44 U7.3
$1I45112\$1N2372: length 2.1
  Top Layer w0.762: R32.2 54.98,127.18 Q11.1
$1I45112\$1N2388: length 2.3
  Bottom Layer w0.508: U9.4 30.9,123.27 R2.2
$1I45112\$1N2393: length 2.5
  Bottom Layer w0.508: 51.53,104.55 49.97,104.55 C32.2
$1I45112\$1N2396: length 2.6
  Bottom Layer w0.762: R26.1 57.53,102.42 U1.8
$1I45112\$1N2398: length 3.2
  Top Layer w0.762: v1(58.9,99.9) 57.73,98.73 57.71,98.73
  Bottom Layer w0.762: R26.2 58.57,99.58 v1(58.9,99.9)
$1I45112\$1N2406: length 5.8
  Bottom Layer w0.508: C8.2 30.34,126.5 L1.1 31.01,124.86 C3.1 31.69,122.24 U9.5
$1I45112\A_REF: length 31.7
  Power w1.016: v1(38.95,111.59) 35.65,114.89 35.65,121.12 v1(36.58,122.05) 36.58,122.81 v1(38.45,124.68) v1(40.98,127.21)
  Bottom Layer w0.508: v1(36.58,122.05) 36.58,121.83 U9.9
  Bottom Layer w1.016: v1(38.95,111.59) 39.92,110.62 R5.1 ; v1(40.98,127.21) 41.79,127.21 R17.1 ; v1(38.45,124.68) 40.74,122.39 R16.1
$1I45112\AU: length 26.2
  Bottom Layer w0.508: v1(44.44,132.83) 41.27,132.83 32.5,124.07 U9.6
  Bottom Layer w1.016: R17.2 R15.2 45.58,131.69 v1(44.44,132.83) 44.43,132.84 R8.1
$1I45112\AV: length 24.5
  Bottom Layer w0.508: v1(43.01,122.45) 39.4,126.07 35.9,126.07 33.3,123.47 U9.7
  Bottom Layer w1.016: R9.2 45.58,119.88 v1(43.01,122.45) 47.99,122.45 R7.1
$1I45112\AW: length 30.4
  Bottom Layer w0.508: v1(43.04,110.61) 41.02,112.63 41.02,119.93 37.42,123.53 34.76,123.53 34.1,122.87 U9.8
  Bottom Layer w1.016: R4.2 45.58,108.07 v1(43.04,110.61) 48.02,110.61 R6.1
$1I45112\BOOT0_ESC: length 8.9
  Bottom Layer w0.508: SW2.2 22.28,122.58 R33.1 22.67,121.8 24.47,120 U9.31
$1I45112\PHASE_U: length 20.1
  Top Layer w2.032: 57.34,131.05 Q11.3 54.15,131.05 v1(52.83,132.37)
  Top Layer w6.35: NOREF#3.1 68.15,129.33 Q10.2
  Bottom Layer w0.508: C7.1 49.72,130.72 U7.4
  Bottom Layer w1.016: v1(52.83,132.37) 51.53,131.07 U7.4
  Bottom Layer w1.143: R8.2 52.36,132.84 v1(52.83,132.37)
$1I45112\PHASE_V: length 20.1
  Top Layer w2.032: 57.34,119.24 Q9.3 54.15,119.24 v1(52.83,120.56)
  Top Layer w6.35: NOREF#7.1 68.18,117.52 Q7.2
  Bottom Layer w0.508: C24.1 49.72,118.9 U10.4
  Bottom Layer w1.016: U10.4 51.53,119.25 v1(52.83,120.56)
  Bottom Layer w1.143: v1(52.83,120.56) 52.36,121.03 R7.2
$1I45112\PHASE_W: length 20.1
  Top Layer w2.032: 57.34,107.42 Q8.3 54.15,107.42 v1(52.83,108.74)
  Top Layer w6.35: Q12.2 68.15,105.71 NOREF#2.1
  Bottom Layer w0.508: C32.1 49.72,107.09 U1.4
  Bottom Layer w1.016: v1(52.83,108.74) 51.53,107.44 U1.4
  Bottom Layer w1.143: v1(52.83,108.74) 52.36,109.22 R6.2
VDDA: length 4.4
  Top Layer w0.254: U8.39 242.39,97.12 242.61,96.9 C93.2 L4.2
BOOT0: length 7.3
  Top Layer w0.254: U8.166 219.89,105.09
  Top Layer w0.508: SW1.2 218.88,107.06 219.89,106.05 219.89,105.12 R75.1
BOOT1: length 1.7
  Top Layer w0.254: U8.58 248.19,106.59 R74.1
$1N17973: length 2.2
  Top Layer w0.254: U8.31 238.39,97.03 R10.2
$1N17975: length 2.5
  Top Layer w0.254: U8.81 247.69,118.09 248.6,117.17 248.6,116.97
